# Altium project PressurePulse_Brain-PCB.PrjPcb (part 1 of 2)
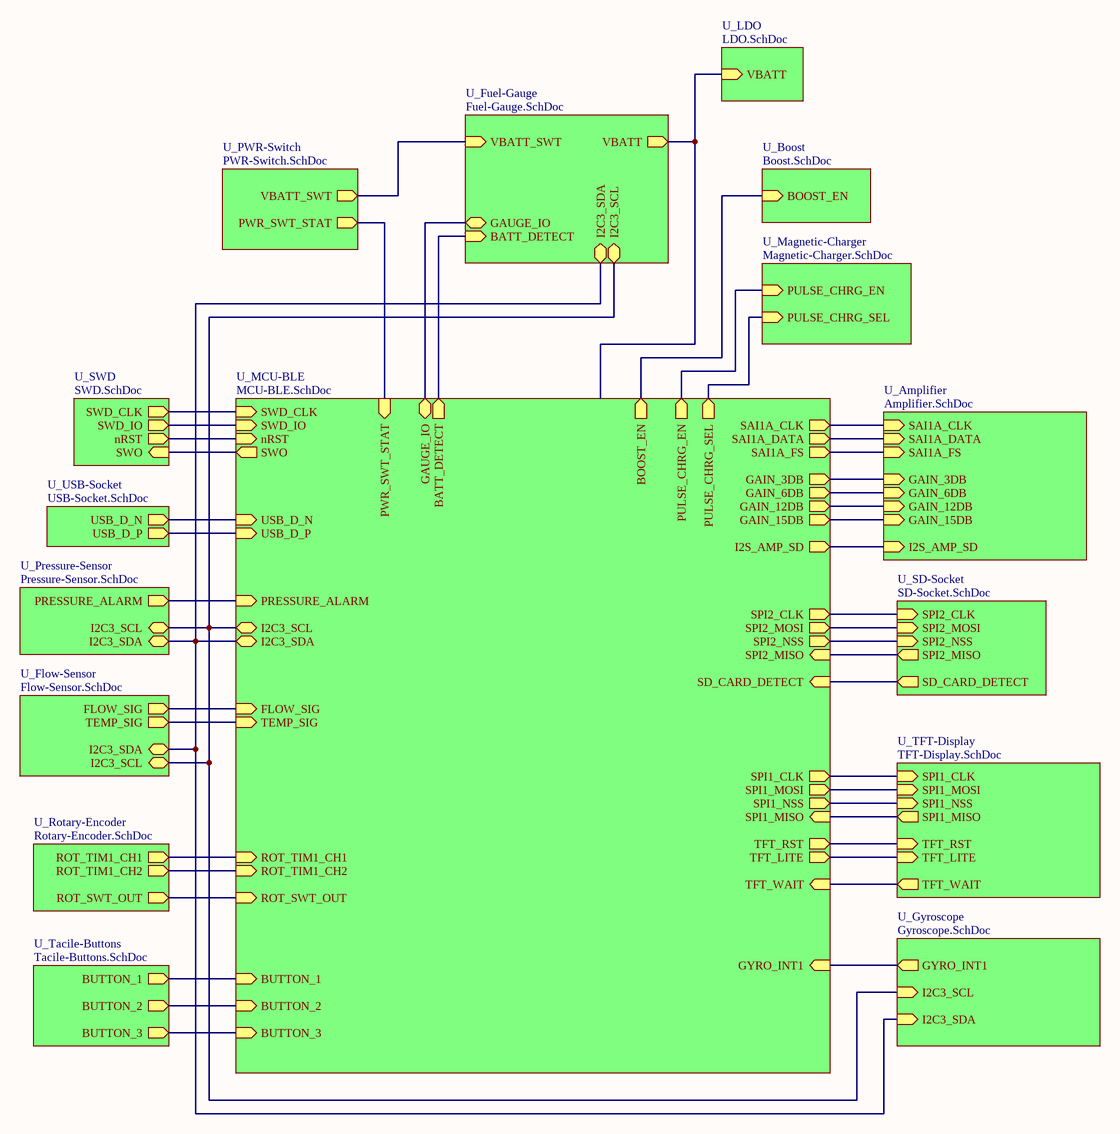
[diagram p0: PressurePulse_Brain-PCB_Master.SchDoc]
17 sheets, 241 parts. Net scope: hierarchical (ports join the sheet entries above them; power ports are global).
Board file: PressurePulse_Brain-PCB.PcbDoc
Sheets:
  PressurePulse_Brain-PCB_Master.SchDoc
    U_MCU-BLE = MCU-BLE.SchDoc
    U_SWD = SWD.SchDoc
    U_USB-Socket = USB-Socket.SchDoc
    U_Pressure-Sensor = Pressure-Sensor.SchDoc
    U_Flow-Sensor = Flow-Sensor.SchDoc
    U_PWR-Switch = PWR-Switch.SchDoc
    U_Fuel-Gauge = Fuel-Gauge.SchDoc
    U_LDO = LDO.SchDoc
    U_Boost = Boost.SchDoc
    U_Magnetic-Charger = Magnetic-Charger.SchDoc
    U_SD-Socket = SD-Socket.SchDoc
    U_TFT-Display = TFT-Display.SchDoc
    U_Amplifier = Amplifier.SchDoc
    U_Rotary-Encoder = Rotary-Encoder.SchDoc
    U_Tacile-Buttons = Tacile-Buttons.SchDoc
    U_Gyroscope = Gyroscope.SchDoc

## Sheet PressurePulse_Brain-PCB_Master.SchDoc
size B; SheetNumber: 1; SheetTotal: 17

### Sub-sheets
U_Amplifier = Amplifier.SchDoc: SAI1A_DATA (in), SAI1A_FS (in), SAI1A_CLK (in), GAIN_3DB (in), GAIN_6DB (in), GAIN_12DB (in), GAIN_15DB (in), I2S_AMP_SD (in)
U_Boost = Boost.SchDoc: BOOST_EN (in)
U_Flow-Sensor = Flow-Sensor.SchDoc: FLOW_SIG (out), TEMP_SIG (out), I2C3_SCL (bidir), I2C3_SDA (bidir)
U_Fuel-Gauge = Fuel-Gauge.SchDoc: I2C3_SCL (bidir), I2C3_SDA (bidir), GAUGE_IO (bidir), BATT_DETECT (in), VBATT_SWT (in), VBATT (out)
U_Gyroscope = Gyroscope.SchDoc: I2C3_SDA (in), GYRO_INT1 (out), I2C3_SCL (in)
U_LDO = LDO.SchDoc: VBATT (in)
U_Magnetic-Charger = Magnetic-Charger.SchDoc: PULSE_CHRG_EN (in), PULSE_CHRG_SEL (in)
U_MCU-BLE = MCU-BLE.SchDoc: SWO (out), SWD_CLK (in), SWD_IO (in), nRST (in), USB_D_N (in), USB_D_P (in), I2C3_SCL (bidir), I2C3_SDA (bidir), SAI1A_DATA (out), SAI1A_CLK (out), SAI1A_FS (out), SPI1_NSS (out), SPI1_CLK (out), SPI1_MISO (in), SPI1_MOSI (out), SPI2_NSS (out), SPI2_MISO (in), SPI2_MOSI (out), FLOW_SIG (in), TEMP_SIG (in), TFT_LITE (out), SPI2_CLK (out), TFT_WAIT (in), TFT_RST (out), BUTTON_1 (in), BUTTON_2 (in), BUTTON_3 (in), PULSE_CHRG_EN (out), SD_CARD_DETECT (in), GAIN_3DB (out), GAIN_6DB (out), GAIN_12DB (out), GAIN_15DB (out), ROT_SWT_OUT (in), PWR_SWT_STAT (in), GAUGE_IO (bidir), BATT_DETECT (out), I2S_AMP_SD (out), ROT_TIM1_CH1 (in), ROT_TIM1_CH2 (in), BOOST_EN (out), PRESSURE_ALARM (in), GYRO_INT1 (in), PULSE_CHRG_SEL (out)
U_Pressure-Sensor = Pressure-Sensor.SchDoc: I2C3_SDA (bidir), I2C3_SCL (bidir), PRESSURE_ALARM (out)
U_PWR-Switch = PWR-Switch.SchDoc: PWR_SWT_STAT (out), VBATT_SWT (out)
U_Rotary-Encoder = Rotary-Encoder.SchDoc: ROT_SWT_OUT (out), ROT_TIM1_CH1 (out), ROT_TIM1_CH2 (out)
U_SD-Socket = SD-Socket.SchDoc: SPI2_CLK (in), SPI2_MOSI (in), SD_CARD_DETECT (out), SPI2_NSS (in), SPI2_MISO (out)
U_SWD = SWD.SchDoc: nRST (out), SWD_IO (out), SWD_CLK (out), SWO (in)
U_Tacile-Buttons = Tacile-Buttons.SchDoc: BUTTON_1 (out), BUTTON_3 (out), BUTTON_2 (out)
U_TFT-Display = TFT-Display.SchDoc: TFT_LITE (in), SPI1_CLK (in), SPI1_MISO (out), SPI1_MOSI (in), SPI1_NSS (in), TFT_RST (in), TFT_WAIT (out)
U_USB-Socket = USB-Socket.SchDoc: USB_D_N (out), USB_D_P (out)

### Nets
VBATT: sheet U_Fuel-Gauge/VBATT, sheet U_LDO/VBATT
BATT_DETECT: sheet U_MCU-BLE/BATT_DETECT, sheet U_Fuel-Gauge/BATT_DETECT
FLOW_SIG: sheet U_MCU-BLE/FLOW_SIG, sheet U_Flow-Sensor/FLOW_SIG
GAUGE_IO: sheet U_MCU-BLE/GAUGE_IO, sheet U_Fuel-Gauge/GAUGE_IO
I2C3_SCL: sheet U_MCU-BLE/I2C3_SCL, sheet U_Pressure-Sensor/I2C3_SCL, sheet U_Flow-Sensor/I2C3_SCL, sheet U_Fuel-Gauge/I2C3_SCL, sheet U_Gyroscope/I2C3_SCL
I2C3_SDA: sheet U_MCU-BLE/I2C3_SDA, sheet U_Pressure-Sensor/I2C3_SDA, sheet U_Flow-Sensor/I2C3_SDA, sheet U_Fuel-Gauge/I2C3_SDA, sheet U_Gyroscope/I2C3_SDA
nRST: sheet U_MCU-BLE/nRST, sheet U_SWD/nRST
PWR_SWT_STAT: sheet U_MCU-BLE/PWR_SWT_STAT, sheet U_PWR-Switch/PWR_SWT_STAT
ROT_SWT_OUT: sheet U_MCU-BLE/ROT_SWT_OUT, sheet U_Rotary-Encoder/ROT_SWT_OUT
ROT_TIM1_CH1: sheet U_MCU-BLE/ROT_TIM1_CH1, sheet U_Rotary-Encoder/ROT_TIM1_CH1
ROT_TIM1_CH2: sheet U_MCU-BLE/ROT_TIM1_CH2, sheet U_Rotary-Encoder/ROT_TIM1_CH2
SAI1A_CLK: sheet U_MCU-BLE/SAI1A_CLK, sheet U_Amplifier/SAI1A_CLK
SAI1A_DATA: sheet U_MCU-BLE/SAI1A_DATA, sheet U_Amplifier/SAI1A_DATA
SAI1A_FS: sheet U_MCU-BLE/SAI1A_FS, sheet U_Amplifier/SAI1A_FS
SD_CARD_DETECT: sheet U_MCU-BLE/SD_CARD_DETECT, sheet U_SD-Socket/SD_CARD_DETECT
SPI1_CLK: sheet U_MCU-BLE/SPI1_CLK, sheet U_TFT-Display/SPI1_CLK
SPI1_MISO: sheet U_MCU-BLE/SPI1_MISO, sheet U_TFT-Display/SPI1_MISO
SPI1_MOSI: sheet U_MCU-BLE/SPI1_MOSI, sheet U_TFT-Display/SPI1_MOSI
SPI1_NSS: sheet U_MCU-BLE/SPI1_NSS, sheet U_TFT-Display/SPI1_NSS
SPI2_CLK: sheet U_MCU-BLE/SPI2_CLK, sheet U_SD-Socket/SPI2_CLK
SPI2_MISO: sheet U_MCU-BLE/SPI2_MISO, sheet U_SD-Socket/SPI2_MISO
SPI2_MOSI: sheet U_MCU-BLE/SPI2_MOSI, sheet U_SD-Socket/SPI2_MOSI
SPI2_NSS: sheet U_MCU-BLE/SPI2_NSS, sheet U_SD-Socket/SPI2_NSS
SWD_CLK: sheet U_MCU-BLE/SWD_CLK, sheet U_SWD/SWD_CLK
SWD_IO: sheet U_MCU-BLE/SWD_IO, sheet U_SWD/SWD_IO
SWO: sheet U_MCU-BLE/SWO, sheet U_SWD/SWO
TEMP_SIG: sheet U_MCU-BLE/TEMP_SIG, sheet U_Flow-Sensor/TEMP_SIG
TFT_WAIT: sheet U_MCU-BLE/TFT_WAIT, sheet U_TFT-Display/TFT_WAIT
USB_D_N: sheet U_MCU-BLE/USB_D_N, sheet U_USB-Socket/USB_D_N
USB_D_P: sheet U_MCU-BLE/USB_D_P, sheet U_USB-Socket/USB_D_P
VBATT_SWT: sheet U_PWR-Switch/VBATT_SWT, sheet U_Fuel-Gauge/VBATT_SWT
NetD22_K: sheet U_MCU-BLE/PRESSURE_ALARM, sheet U_Pressure-Sensor/PRESSURE_ALARM
NetD34_K: sheet U_MCU-BLE/TFT_RST, sheet U_TFT-Display/TFT_RST
NetD35_K: sheet U_MCU-BLE/TFT_LITE, sheet U_TFT-Display/TFT_LITE
NetJ12_2: sheet U_MCU-BLE/PULSE_CHRG_SEL, sheet U_Magnetic-Charger/PULSE_CHRG_SEL
NetQ6_G: sheet U_MCU-BLE/GAIN_3DB, sheet U_Amplifier/GAIN_3DB
NetQ7_G: sheet U_MCU-BLE/GAIN_6DB, sheet U_Amplifier/GAIN_6DB
NetQ8_G: sheet U_MCU-BLE/GAIN_15DB, sheet U_Amplifier/GAIN_15DB
NetQ9_G: sheet U_MCU-BLE/GAIN_12DB, sheet U_Amplifier/GAIN_12DB
NetR22_2: sheet U_MCU-BLE/BOOST_EN, sheet U_Boost/BOOST_EN
NetR61_2: sheet U_MCU-BLE/PULSE_CHRG_EN, sheet U_Magnetic-Charger/PULSE_CHRG_EN
NetR67_2: sheet U_MCU-BLE/I2S_AMP_SD, sheet U_Amplifier/I2S_AMP_SD
NetSW3_1: sheet U_MCU-BLE/BUTTON_1, sheet U_Tacile-Buttons/BUTTON_1
NetSW4_1: sheet U_MCU-BLE/BUTTON_2, sheet U_Tacile-Buttons/BUTTON_2
NetSW5_1: sheet U_MCU-BLE/BUTTON_3, sheet U_Tacile-Buttons/BUTTON_3
NetU6_17: sheet U_MCU-BLE/GYRO_INT1, sheet U_Gyroscope/GYRO_INT1

## Sheet MCU-BLE.SchDoc
size 431 x 304 mm; SheetNumber: 6; SheetTotal: 17
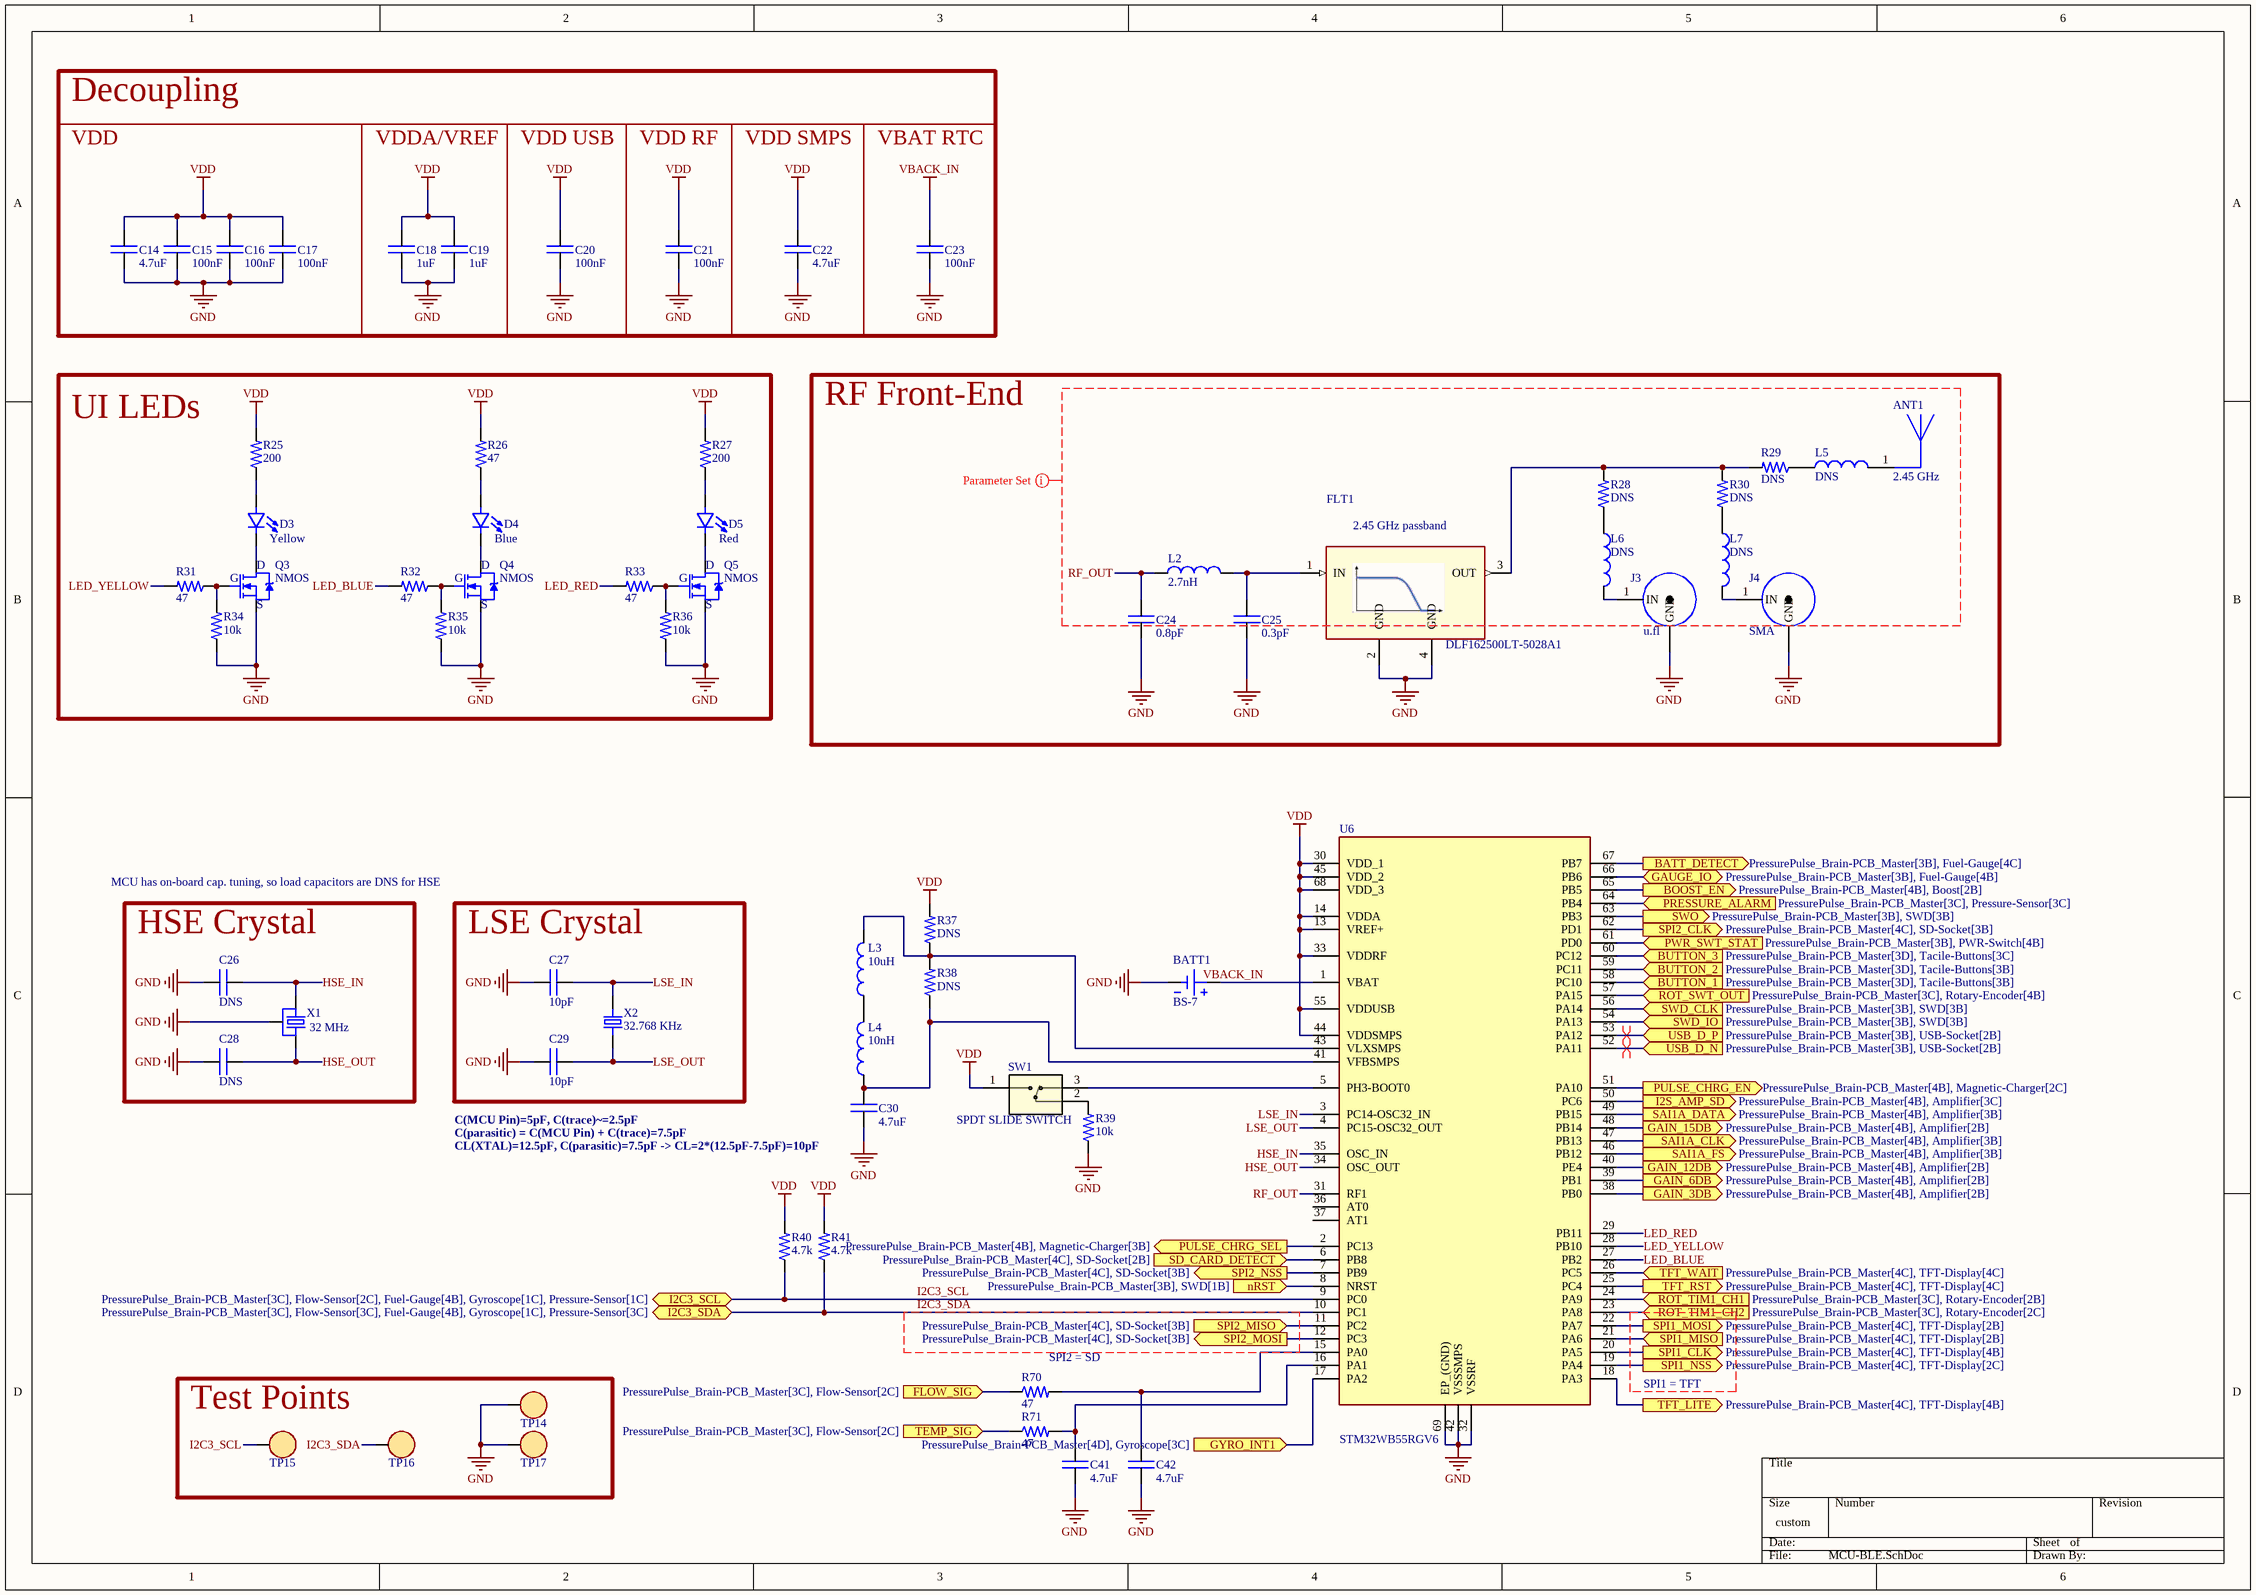
[diagram p1: MCU-BLE.SchDoc]

### Parts
ANT1  Center Frequency: 2.45 GHz  [ANT_ANT7020LL05R0870A_PUL-L]  (hidden comment: CHIP ANTENNA)
BATT1  BS-7  [BAT_BS-7]
C14  value 4.7uF  [0402C]  (hidden comment: CAP)
C15  value 100nF  [0402C]  (hidden comment: CAP)
C16  value 100nF  [0402C]  (hidden comment: CAP)
C17  value 100nF  [0402C]  (hidden comment: CAP)
C18  value 1uF  [0402C]  (hidden comment: CAP)
C19  value 1uF  [0402C]  (hidden comment: CAP)
C20  value 100nF  [0402C]  (hidden comment: CAP)
C21  value 100nF  [0402C]  (hidden comment: CAP)
C22  value 4.7uF  [0402C]  (hidden comment: CAP)
C23  value 100nF  [0402C]  (hidden comment: CAP)
C24  value 0.8pF  [0603C]  (hidden comment: CAP)
C25  value 0.3pF  [0402C]  (hidden comment: CAP)
C26  value DNS  [0402C]  (hidden comment: CAP)
C27  value 10pF  [0402C]  (hidden comment: CAP)
C28  value DNS  [0402C]  (hidden comment: CAP)
C29  value 10pF  [0402C]  (hidden comment: CAP)
C30  value 4.7uF  [0402C]  (hidden comment: CAP)
C41  value 4.7uF  [0402C]  (hidden comment: CAP)
C42  value 4.7uF  [0402C]  (hidden comment: CAP)
D3  Color: Yellow  [0603-LED]  (hidden comment: LED - single)
D4  Color: Blue  [0603-LED]  (hidden comment: LED - single)
D5  Color: Red  [0603-LED]  (hidden comment: LED - single)
FLT1  DLF162500LT-5028A1  [DLF-4_1P6X0P8]
J3  u.fl  [U.FL]
J4  SMA  [SMA TH RA]
L2  value 2.7nH  [0402L]  (hidden comment: IND)
L3  value 10uH  [0805L]  (hidden comment: IND)
L4  value 10nH  [0402L]  (hidden comment: IND)
L5  value DNS  [0402L]  (hidden comment: IND)
L6  value DNS  [0402L]  (hidden comment: IND)
L7  value DNS  [0402L]  (hidden comment: IND)
Q3  NMOS  [SOT-23]
Q4  NMOS  [SOT-23]
Q5  NMOS  [SOT-23]
R25  value 200  [0402R]  (hidden comment: RES)
R26  value 47  [0402R]  (hidden comment: RES)
R27  value 200  [0402R]  (hidden comment: RES)
R28  value DNS  [0402R]  (hidden comment: RES)
R29  value DNS  [0402R]  (hidden comment: RES)
R30  value DNS  [0402R]  (hidden comment: RES)
R31  value 47  [0402R]  (hidden comment: RES)
R32  value 47  [0402R]  (hidden comment: RES)
R33  value 47  [0402R]  (hidden comment: RES)
R34  value 10k  [0402R]  (hidden comment: RES)
R35  value 10k  [0402R]  (hidden comment: RES)
R36  value 10k  [0402R]  (hidden comment: RES)
R37  value DNS  [0402R]  (hidden comment: RES)
R38  value DNS  [0402R]  (hidden comment: RES)
R39  value 10k  [0402R]  (hidden comment: RES)
R40  value 4.7k  [0402R]  (hidden comment: RES)
R41  value 4.7k  [0402R]  (hidden comment: RES)
R70  value 47  [0402R]  (hidden comment: RES)
R71  value 47  [0402R]  (hidden comment: RES)
SW1  SPDT SLIDE SWITCH  [JS102011SCQN]
TP14  RH-5019  [TP - RH-5019]  (value not drawn)
TP15  RH-5019  [TP - RH-5019]  (value not drawn)
TP16  RH-5019  [TP - RH-5019]  (value not drawn)
TP17  RH-5019  [TP - RH-5019]  (value not drawn)
U6  STM32WB55RGV6  [VQFN-68]
X1  Frequency: 32 MHz  [32MHZ_SMD1612-4P]  (hidden comment: XTAL-OSC_32MHz)
X2  Frequency: 32.768 KHz  [XTAL_ECS-.327-12.5-34B-TR]  (hidden comment: XTAL-OSC_32.768kHz)

### Blocks framed on the sheet
Decoupling: C14-C17
VDDA/VREF: C18 C19
VDD USB: C20
VDD RF: C21
VDD SMPS: C22
VBAT RTC: C23
UI LEDs: D3-D5 Q3-Q5 R25-R27 R31-R36
RF Front-End: ANT1 C24 C25 FLT1 J3 J4 L2 L5-L7 R28-R30
HSE Crystal: C26 C28 X1
LSE Crystal: C27 C29 X2
Test Points: TP14-TP17

### Ports
BATT_DETECT (out, see PressurePulse_Brain-PCB_Master[3B], Fuel-Gauge[4C]), BOOST_EN (out, see PressurePulse_Brain-PCB_Master[4B], Boost[2B]), BUTTON_1 (in, see PressurePulse_Brain-PCB_Master[3D], Tacile-Buttons[3B]), BUTTON_2 (in, see PressurePulse_Brain-PCB_Master[3D], Tacile-Buttons[3B]), BUTTON_3 (in, see PressurePulse_Brain-PCB_Master[3D], Tacile-Buttons[3C]), FLOW_SIG (in, see PressurePulse_Brain-PCB_Master[3C], Flow-Sensor[2C]), GAIN_3DB (out, see PressurePulse_Brain-PCB_Master[4B], Amplifier[2B]), GAIN_6DB (out, see PressurePulse_Brain-PCB_Master[4B], Amplifier[2B]), GAIN_12DB (out, see PressurePulse_Brain-PCB_Master[4B], Amplifier[2B]), GAIN_15DB (out, see PressurePulse_Brain-PCB_Master[4B], Amplifier[2B]), GAUGE_IO (bidir, see PressurePulse_Brain-PCB_Master[3B], Fuel-Gauge[4B]), GYRO_INT1 (in, see PressurePulse_Brain-PCB_Master[4D], Gyroscope[3C]), I2C3_SCL (bidir, see PressurePulse_Brain-PCB_Master[3C], Flow-Sensor[2C], Fuel-Gauge[4B], Gyroscope[1C], Pressure-Sensor[1C]), I2C3_SDA (bidir, see PressurePulse_Brain-PCB_Master[3C], Flow-Sensor[3C], Fuel-Gauge[4B], Gyroscope[1C], Pressure-Sensor[3C]), I2S_AMP_SD (out, see PressurePulse_Brain-PCB_Master[4B], Amplifier[3C]), nRST (in, see PressurePulse_Brain-PCB_Master[3B], SWD[1B]), PRESSURE_ALARM (in, see PressurePulse_Brain-PCB_Master[3C], Pressure-Sensor[3C]), PULSE_CHRG_EN (out, see PressurePulse_Brain-PCB_Master[4B], Magnetic-Charger[2C]), PULSE_CHRG_SEL (out, see PressurePulse_Brain-PCB_Master[4B], Magnetic-Charger[3B]), PWR_SWT_STAT (in, see PressurePulse_Brain-PCB_Master[3B], PWR-Switch[4B]), ROT_SWT_OUT (in, see PressurePulse_Brain-PCB_Master[3C], Rotary-Encoder[4B]), ROT_TIM1_CH1 (in, see PressurePulse_Brain-PCB_Master[3C], Rotary-Encoder[2B]), ROT_TIM1_CH2 (in, see PressurePulse_Brain-PCB_Master[3C], Rotary-Encoder[2C]), SAI1A_CLK (out, see PressurePulse_Brain-PCB_Master[4B], Amplifier[3B]), SAI1A_DATA (out, see PressurePulse_Brain-PCB_Master[4B], Amplifier[3B]), SAI1A_FS (out, see PressurePulse_Brain-PCB_Master[4B], Amplifier[3B]), SD_CARD_DETECT (in, see PressurePulse_Brain-PCB_Master[4C], SD-Socket[2B]), SPI1_CLK (out, see PressurePulse_Brain-PCB_Master[4C], TFT-Display[4B]), SPI1_MISO (in, see PressurePulse_Brain-PCB_Master[4C], TFT-Display[2B]), SPI1_MOSI (out, see PressurePulse_Brain-PCB_Master[4C], TFT-Display[2B]), SPI1_NSS (out, see PressurePulse_Brain-PCB_Master[4C], TFT-Display[2C]), SPI2_CLK (out, see PressurePulse_Brain-PCB_Master[4C], SD-Socket[3B]), SPI2_MISO (in, see PressurePulse_Brain-PCB_Master[4C], SD-Socket[3B]), SPI2_MOSI (out, see PressurePulse_Brain-PCB_Master[4C], SD-Socket[3B]), SPI2_NSS (out, see PressurePulse_Brain-PCB_Master[4C], SD-Socket[3B]), SWD_CLK (in, see PressurePulse_Brain-PCB_Master[3B], SWD[3B]), SWD_IO (in, see PressurePulse_Brain-PCB_Master[3B], SWD[3B]), SWO (out, see PressurePulse_Brain-PCB_Master[3B], SWD[3B]), TEMP_SIG (in, see PressurePulse_Brain-PCB_Master[3C], Flow-Sensor[2C]), TFT_LITE (out, see PressurePulse_Brain-PCB_Master[4C], TFT-Display[4B]), TFT_RST (out, see PressurePulse_Brain-PCB_Master[4C], TFT-Display[4C]), TFT_WAIT (in, see PressurePulse_Brain-PCB_Master[4C], TFT-Display[4C]), USB_D_N (in, see PressurePulse_Brain-PCB_Master[3B], USB-Socket[2B]), USB_D_P (in, see PressurePulse_Brain-PCB_Master[3B], USB-Socket[2B])

### Nets
GND: BATT1.2(NEG) C14.1 C15.1 C16.1 C17.1 C18.1 C19.1 C20.1 C21.1 C22.1 C23.1 C24.1 C25.1 C26.2 C27.2 C28.2 C29.2 C30.1 C41.1 C42.1 FLT1.2(GND) FLT1.4(GND) J3.GND J4.GND Q3.S Q4.S Q5.S R34.1 R35.1 R36.1 R39.1 TP14.1 TP17.1 U6.32(VSSRF) U6.42(VSSSMPS) U6.69(EP_(GND)) X1.GND
VBACK_IN: BATT1.1(POS) C23.2 U6.1(VBAT)
VDD: C14.2 C15.2 C16.2 C17.2 C18.2 C19.2 C20.2 C21.2 C22.2 R25.2 R26.2 R27.2 R37.2 R40.2 R41.2 SW1.1 U6.13(VREF+) U6.14(VDDA) U6.30(VDD_1) U6.33(VDDRF) U6.44(VDDSMPS) U6.45(VDD_2) U6.55(VDDUSB) U6.68(VDD_3)
BATT_DETECT: U6.67(PB7) ; port BATT_DETECT
FLOW_SIG: R70.1 ; port FLOW_SIG
GAUGE_IO: U6.66(PB6) ; port GAUGE_IO
HSE_IN: C26.1 U6.35(OSC_IN) X1.1
HSE_OUT: C28.1 U6.34(OSC_OUT) X1.3
I2C3_SCL: R40.1 TP15.1 U6.9(PC0) ; port I2C3_SCL
I2C3_SDA: R41.1 TP16.1 U6.10(PC1) ; port I2C3_SDA
LED_BLUE: R32.2 U6.27(PB2)
LED_RED: R33.2 U6.29(PB11)
LED_YELLOW: R31.2 U6.28(PB10)
LSE_IN: C27.1 U6.3(PC14-OSC32_IN) X2.2
LSE_OUT: C29.1 U6.4(PC15-OSC32_OUT) X2.1
nRST: U6.8(NRST) ; port nRST
PWR_SWT_STAT: U6.61(PD0) ; port PWR_SWT_STAT
RF_OUT: C24.2 L2.1 U6.31(RF1)
ROT_SWT_OUT: U6.57(PA15) ; port ROT_SWT_OUT
ROT_TIM1_CH1: U6.24(PA9) ; port ROT_TIM1_CH1
ROT_TIM1_CH2: U6.23(PA8) ; port ROT_TIM1_CH2
SAI1A_CLK: U6.47(PB13) ; port SAI1A_CLK
SAI1A_DATA: U6.49(PB15) ; port SAI1A_DATA
SAI1A_FS: U6.46(PB12) ; port SAI1A_FS
SD_CARD_DETECT: U6.6(PB8) ; port SD_CARD_DETECT
SPI1_CLK: U6.20(PA5) ; port SPI1_CLK
SPI1_MISO: U6.21(PA6) ; port SPI1_MISO
SPI1_MOSI: U6.22(PA7) ; port SPI1_MOSI
SPI1_NSS: U6.19(PA4) ; port SPI1_NSS
SPI2_CLK: U6.62(PD1) ; port SPI2_CLK
SPI2_MISO: U6.11(PC2) ; port SPI2_MISO
SPI2_MOSI: U6.12(PC3) ; port SPI2_MOSI
SPI2_NSS: U6.7(PB9) ; port SPI2_NSS
SWD_CLK: U6.56(PA14) ; port SWD_CLK
SWD_IO: U6.54(PA13) ; port SWD_IO
SWO: U6.63(PB3) ; port SWO
TEMP_SIG: R71.1 ; port TEMP_SIG
TFT_WAIT: U6.26(PC5) ; port TFT_WAIT
USB_D_N: U6.52(PA11) ; port USB_D_N
USB_D_P: U6.53(PA12) ; port USB_D_P
NetANT1_1: ANT1.1 L5.2
NetC25_2: C25.2 FLT1.1(IN) L2.2
NetC30_2: C30.2 L4.1 R38.1 U6.41(VFBSMPS)
NetC41_2: C41.2 R71.2 U6.16(PA1)
NetC42_2: C42.2 R70.2 U6.15(PA0)
NetD3_1: D3.1(A) R25.1
NetD3_2: D3.2(C) Q3.D
NetD4_1: D4.1(A) R26.1
NetD4_2: D4.2(C) Q4.D
NetD5_1: D5.1(A) R27.1
NetD5_2: D5.2(C) Q5.D
NetD22_K: U6.64(PB4) ; port PRESSURE_ALARM
NetD34_K: U6.25(PC4) ; port TFT_RST
NetD35_K: U6.18(PA3) ; port TFT_LITE
NetFLT1_3: FLT1.3(OUT) R28.2 R29.2 R30.2
NetJ3_1: J3.1(IN) L6.2
NetJ4_1: J4.1(IN) L7.2
NetJ12_2: U6.2(PC13) ; port PULSE_CHRG_SEL
NetL3_1: L3.1 L4.2
NetL3_2: L3.2 R37.1 R38.2 U6.43(VLXSMPS)
NetL5_1: L5.1 R29.1
NetL6_1: L6.1 R28.1
NetL7_1: L7.1 R30.1
NetQ3_G: Q3.G R31.1 R34.2
NetQ4_G: Q4.G R32.1 R35.2
NetQ5_G: Q5.G R33.1 R36.2
NetQ6_G: U6.38(PB0) ; port GAIN_3DB
NetQ7_G: U6.39(PB1) ; port GAIN_6DB
NetQ8_G: U6.48(PB14) ; port GAIN_15DB
NetQ9_G: U6.40(PE4) ; port GAIN_12DB
NetR22_2: U6.65(PB5) ; port BOOST_EN
NetR39_2: R39.2 SW1.2
NetR61_2: U6.51(PA10) ; port PULSE_CHRG_EN
NetR67_2: U6.50(PC6) ; port I2S_AMP_SD
NetSW1_3: SW1.3 U6.5(PH3-BOOT0)
NetSW3_1: U6.58(PC10) ; port BUTTON_1
NetSW4_1: U6.59(PC11) ; port BUTTON_2
NetSW5_1: U6.60(PC12) ; port BUTTON_3
NetU6_17: U6.17(PA2) ; port GYRO_INT1

Not connected (* = marked no-connect by the designer): U6 36(AT0) 37(AT1)

### Layout directives
differential pair: USB_D_N, USB_D_P
net class RF: RF_OUT

### Notes on the sheet
- VDD
- MCU has on-board cap. tuning, so load capacitors are DNS for HSE
- (near C30) CL(XTAL)=12.5pF, C(parasitic)=7.5pF -> CL=2*(12.5pF-7.5pF)=10pF
- C(MCU Pin)=5pF, C(trace)~=2.5pF
- C(parasitic) = C(MCU Pin) + C(trace)=7.5pF
- (near R70) SPI2 = SD
- SPI1 = TFT
- (in symbol 2.45GHz LPF) 2.45 GHz passband

### Library data of the parts
ANT1 = CHIP ANTENNA: MFR: Pulse Electronics; MFR PN: ANT7020LL05R2400A; Value: DNS; JLCPCB PN: DNS
BATT1 = COIN CELL BATT: Battery Holder (Open) Coin, 20.0mm 1 Cell PC Pin; MP: BS-2-1; MF: Q&J; Value: BS-2-1; JLCPCB PN: C70376
C14-C23 C26 C28 C30 = CAP: Capaicitor; MFR: *; MFR PN: *
C24 C25 C41 C42 = CAP: Capacitor; MFR: *; MFR PN: *
  C24: JLCPCB PN: C907996; Footprint: 0603
  C25: JLCPCB PN: C2986289; Footprint: *
  C41 C42: JLCPCB PN: *; Footprint: *
C27 C29 = CAP: Capaicitor; MFR PN: FN15N100J500PNG; MFR: *; JLCPCB PN: C328913
D3 = LED - single: LED; Value: 19-213/Y2C-CQ2R2L/3T(CY); MFR: *; MFR PN: *; JLCPCB PN: C72038
D4 = LED - single: LED; Value: D-060306B1; MFR: *; MFR PN: *; JLCPCB PN: C118339
D5 = LED - single: LED; Value: KT-0603R; MFR: *; MFR PN: *; JLCPCB PN: C2286
FLT1 = 2.45GHz LPF: RF FILTER LOW PASS 2.45GHZ 0603; MFR: TDK; MFR PN: DLF162500LT-5028A1; Value: DLF162500LT-5028A1; JLCPCB PN: C531364
J3 = u.fl CONN: u.fl 50Ohm; MFR: HRS(Hirose); MFR PN: U.FL-R-SMT-1(80); Value: U.FL-R-SMT-1(80); JLCPCB PN: C88374
J4 = SMA: SMA 50Ohm; MFR: DreamLNK; MFR PN: SMA-KWE901; Value: SMA-KWE901; JLCPCB PN: C914553
L2-L7 = IND: INDUCTOR; Footprint: *
  L2: JLCPCB PN: C963981
  L4: JLCPCB PN: C963995
  L5-L7: JLCPCB PN: *
Q3-Q5 = NMOS: 100V 1.6A 1.3W 220mΩ@10V,1.6A N Channel SOT-23  MOSFETs ROHS; MFR: Infineon; Value: IRLML0100TRPBF; MFR PN: IRLML0100TRPBF; JLCPCB PN: C53658
R25-R41 R70 R71 = RES: Resistor; MFR PN: *; MFR: *
  R25-R27 R37 R38: Type: SMD
  R28-R33 R40 R41 R70 R71: JLCPCB PN: *
  R34-R36: JLCPCB PN: C843837
  R39: Type: SMD; JLCPCB PN: C843837
SW1 = SPDT SLIDE SWITCH: MFR: C&K; Value: JS102011SCQN; MFR PN: JS102011SCQN; Type: SMD; JLCPCB PN: C221661
TP14-TP17 = TEST POINT: MFR: ronghe; MFR PN: RH-5019; Value: RH-5019; JLCPCB PN: C5199800
U6 = STM32WB55RGV6: ARM Microcontrollers - MCU Ultra-low-power dual core Arm Cortex-M4 MCU 64 MHz, Cortex-M0 32MHz with 1 Mbyte Flash, BLE, 802.15.4, USB, LCD, AES-256; MFR: STMicroelectronics; Value: STM32WB55RGV6; JLCPCB PN: C401505
X1 = XTAL-OSC_32MHz: SMD Tuning Fork Crystal; MFR PN: Murata; Value: XRCMD32M000FXP50R0; Type: SMD; JLCPCB PN: C341820
X2 = XTAL-OSC_32.768kHz: 32.768kHz 12.5pF ±20ppm SMD3215-2P  Crystals ROHS; MFR: CITIZEN; MFR PN: CM315D32768DZFT; Value: CM315D32768DZFT; JLCPCB PN: C182057

## Sheet SWD.SchDoc
size A; SheetNumber: 7; SheetTotal: 17
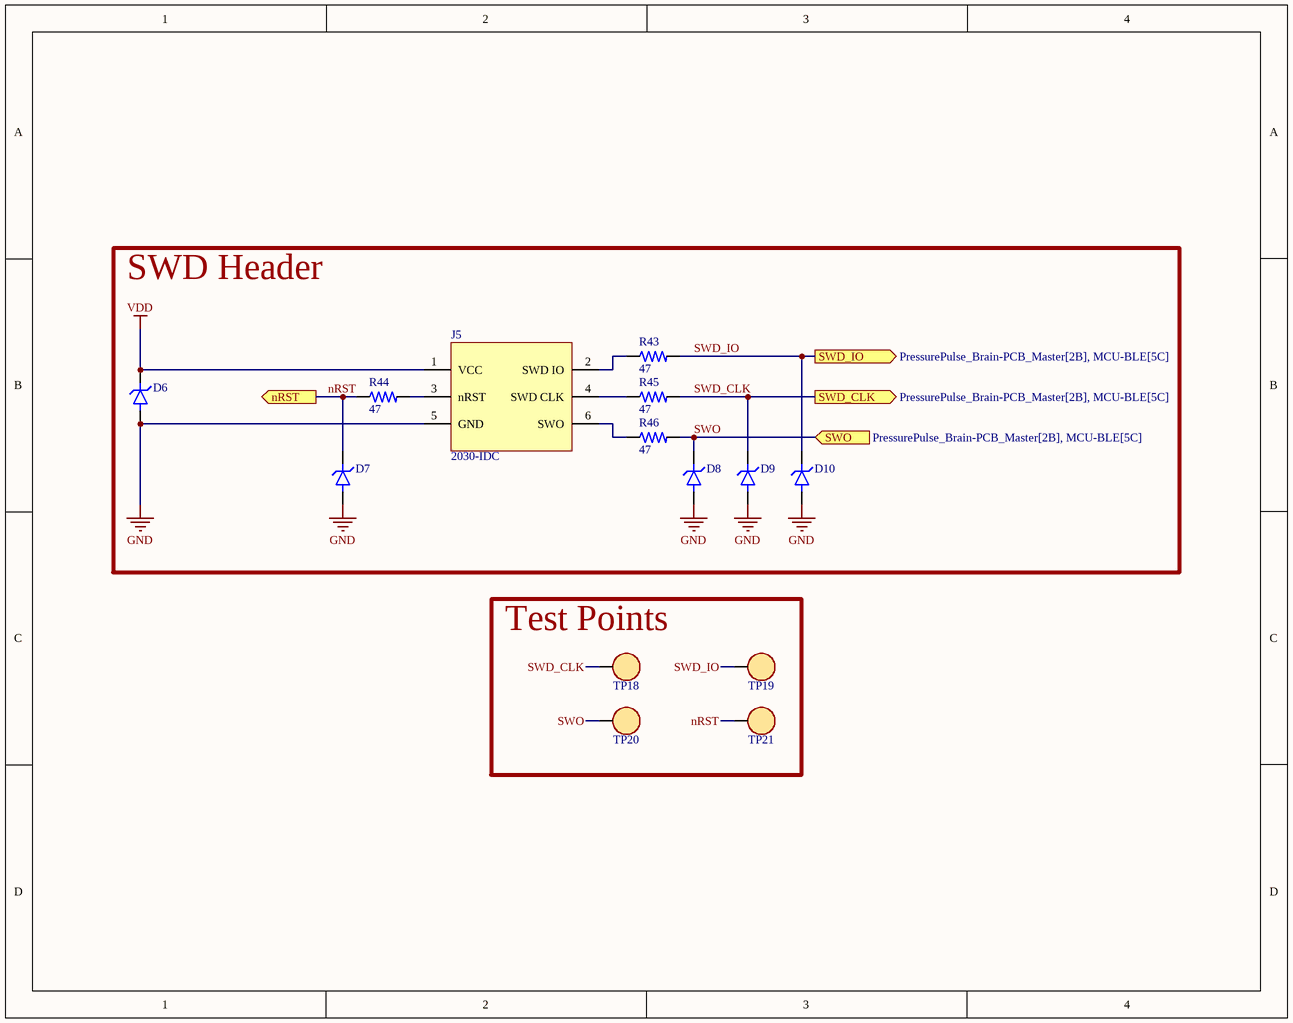
[diagram p2: SWD.SchDoc]

### Parts
D6  RCLAMP0521P.TCT  [BDFN2C051V40]  (value not drawn)
D7  RCLAMP0521P.TCT  [BDFN2C051V40]  (value not drawn)
D8  RCLAMP0521P.TCT  [BDFN2C051V40]  (value not drawn)
D9  RCLAMP0521P.TCT  [BDFN2C051V40]  (value not drawn)
D10  RCLAMP0521P.TCT  [BDFN2C051V40]  (value not drawn)
J5  2030-IDC  [TAG CONNECT TC2030IDC - NO 3D MODEL]
R43  value 47  [0402R]  (hidden comment: RES)
R44  value 47  [0402R]  (hidden comment: RES)
R45  value 47  [0402R]  (hidden comment: RES)
R46  value 47  [0402R]  (hidden comment: RES)
TP18  RH-5019  [TP - RH-5019]  (value not drawn)
TP19  RH-5019  [TP - RH-5019]  (value not drawn)
TP20  RH-5019  [TP - RH-5019]  (value not drawn)
TP21  RH-5019  [TP - RH-5019]  (value not drawn)

### Blocks framed on the sheet
SWD Header: D6-D10 J5 R43-R46
Test Points: TP18-TP21

### Ports
nRST (out, see PressurePulse_Brain-PCB_Master[2B], MCU-BLE[4D]), SWD_CLK (out, see PressurePulse_Brain-PCB_Master[2B], MCU-BLE[5C]), SWD_IO (out, see PressurePulse_Brain-PCB_Master[2B], MCU-BLE[5C]), SWO (in, see PressurePulse_Brain-PCB_Master[2B], MCU-BLE[5C])

### Nets
GND: D6.A D7.A D8.A D9.A D10.A J5.5(GND)
VDD: D6.K J5.1(VCC)
nRST: D7.K R44.1 TP21.1 ; port nRST
SWD_CLK: D9.K R45.2 TP18.1 ; port SWD_CLK
SWD_IO: D10.K R43.2 TP19.1 ; port SWD_IO
SWO: D8.K R46.2 TP20.1 ; port SWO
NetJ5_2: J5.2(SWD_IO) R43.1
NetJ5_3: J5.3(nRST) R44.2
NetJ5_4: J5.4(SWD_CLK) R45.1
NetJ5_6: J5.6(SWO) R46.1

### Library data of the parts
D6-D10 = TVS DIODE: 25V Clamp 4A (8/20µs) Ipp Tvs Diode Surface Mount SLP1006P2; MFR: BORN; Type: SMD; Value: BDFN2C051V40; MFR PN: BDFN2C051V40; JLCPCB PN: C152023
J5 = TAG CONNECT 2030-IDC: MFR PN: TC2030-IDC; Value: DNS; MFR: Tag Connect
R43-R46 = RES: Resistor; MFR PN: *; MFR: *; JLCPCB PN: *
TP18-TP21 = TEST POINT: MFR: ronghe; MFR PN: RH-5019; Value: RH-5019; JLCPCB PN: C5199800

## Sheet USB-Socket.SchDoc
size A; SheetNumber: 10; SheetTotal: 17
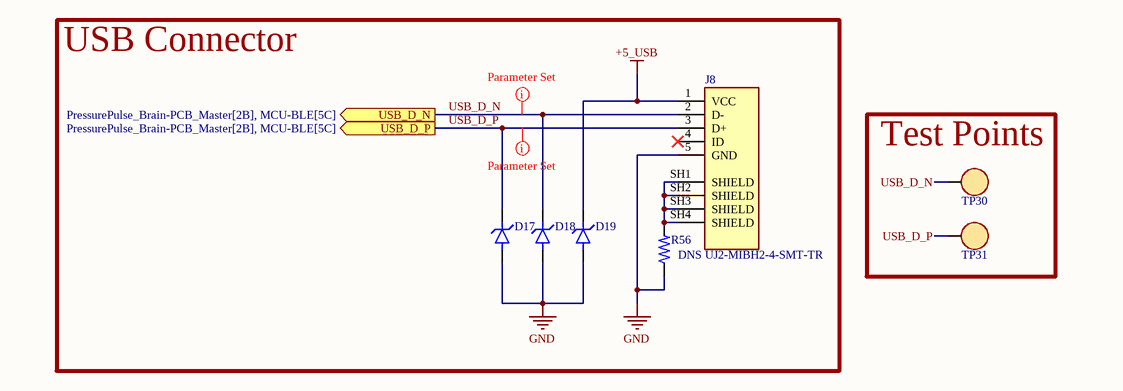
[diagram p3: USB-Socket.SchDoc]

### Parts
D17  RCLAMP0521P.TCT  [BDFN2C051V40]  (value not drawn)
D18  RCLAMP0521P.TCT  [BDFN2C051V40]  (value not drawn)
D19  RCLAMP0521P.TCT  [BDFN2C051V40]  (value not drawn)
J8  UJ2-MIBH2-4-SMT-TR  [USB MICRO JLC]
R56  value DNS  [0402R]  (hidden comment: RES)
TP30  RH-5019  [TP - RH-5019]  (value not drawn)
TP31  RH-5019  [TP - RH-5019]  (value not drawn)

### Blocks framed on the sheet
USB Connector: D17-D19 J8 R56
Test Points: TP30 TP31

### Ports
USB_D_N (out, see PressurePulse_Brain-PCB_Master[2B], MCU-BLE[5C]), USB_D_P (out, see PressurePulse_Brain-PCB_Master[2B], MCU-BLE[5C])

### Nets
+5_USB: D19.K J8.1(VCC)
GND: D17.A D18.A D19.A J8.5(GND) R56.1
USB_D_N: D18.K J8.2(D-) TP30.1 ; port USB_D_N
USB_D_P: D17.K J8.3(D+) TP31.1 ; port USB_D_P
NetJ8_SH1: J8.SH1(SHIELD) J8.SH2(SHIELD) J8.SH3(SHIELD) J8.SH4(SHIELD) R56.2

Not connected (* = marked no-connect by the designer): J8 4(ID)*

### Layout directives
net class USB: USB_D_N, USB_D_P

### Library data of the parts
D17-D19 = TVS DIODE: as D6 on sheet SWD; MFR PN: BDFN2C051V40; JLCPCB PN: C152023
J8 = Micro USB Port: Micro B, USB 2.0, 1.8 A, Right Angle, Surface Mount (SMT), USB Receptacle; MFR: CUI Devices; Value: UA0507065250-037-06; JLCPCB PN: C5249562
R56 = RES: Resistor; MFR PN: *; MFR: *; JLCPCB PN: *
TP30 TP31 = TEST POINT: MFR: ronghe; MFR PN: RH-5019; Value: RH-5019; JLCPCB PN: C5199800

## Sheet Pressure-Sensor.SchDoc
size A; SheetNumber: 11; SheetTotal: 17
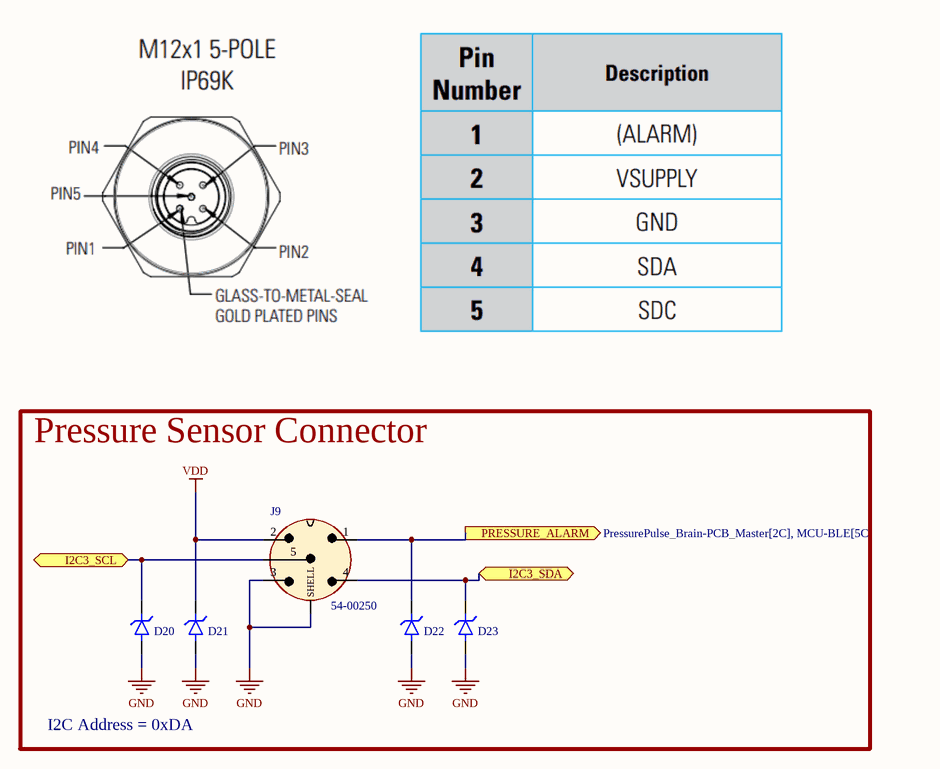
[diagram p4: Pressure-Sensor.SchDoc]

### Parts
D20  RCLAMP0521P.TCT  [BDFN2C051V40]  (value not drawn)
D21  RCLAMP0521P.TCT  [BDFN2C051V40]  (value not drawn)
D22  RCLAMP0521P.TCT  [BDFN2C051V40]  (value not drawn)
D23  RCLAMP0521P.TCT  [BDFN2C051V40]  (value not drawn)
J9  54-00250  [TENSILITY_54-00250]

### Ports
I2C3_SCL (bidir, see PressurePulse_Brain-PCB_Master[2C], Flow-Sensor[2C], Fuel-Gauge[4B], Gyroscope[1C], MCU-BLE[2D]), I2C3_SDA (bidir, see PressurePulse_Brain-PCB_Master[2C], Flow-Sensor[3C], Fuel-Gauge[4B], Gyroscope[1C], MCU-BLE[2D]), PRESSURE_ALARM (out, see PressurePulse_Brain-PCB_Master[2C], MCU-BLE[5C])

### Nets
GND: D20.A D21.A D22.A D23.A J9.3 J9.SHELL
VDD: D21.K J9.2
I2C3_SCL: D20.K J9.5 ; port I2C3_SCL
I2C3_SDA: D23.K J9.4 ; port I2C3_SDA
NetD22_K: D22.K J9.1 ; port PRESSURE_ALARM

### Notes on the sheet
- Pressure Sensor Connector
- I2C Address = 0xDA

### Library data of the parts
D20-D23 = TVS DIODE: as D6 on sheet SWD; MFR PN: BDFN2C051V40; JLCPCB PN: C152023
J9 = M12 5POS TH RA: CONN PLUG MALE 5POS GOLD SOLDER; MFR: Tensility International Corp; Value: DNS; MFR PN: 54-00250

## Sheet Flow-Sensor.SchDoc
size A; SheetNumber: 12; SheetTotal: 17
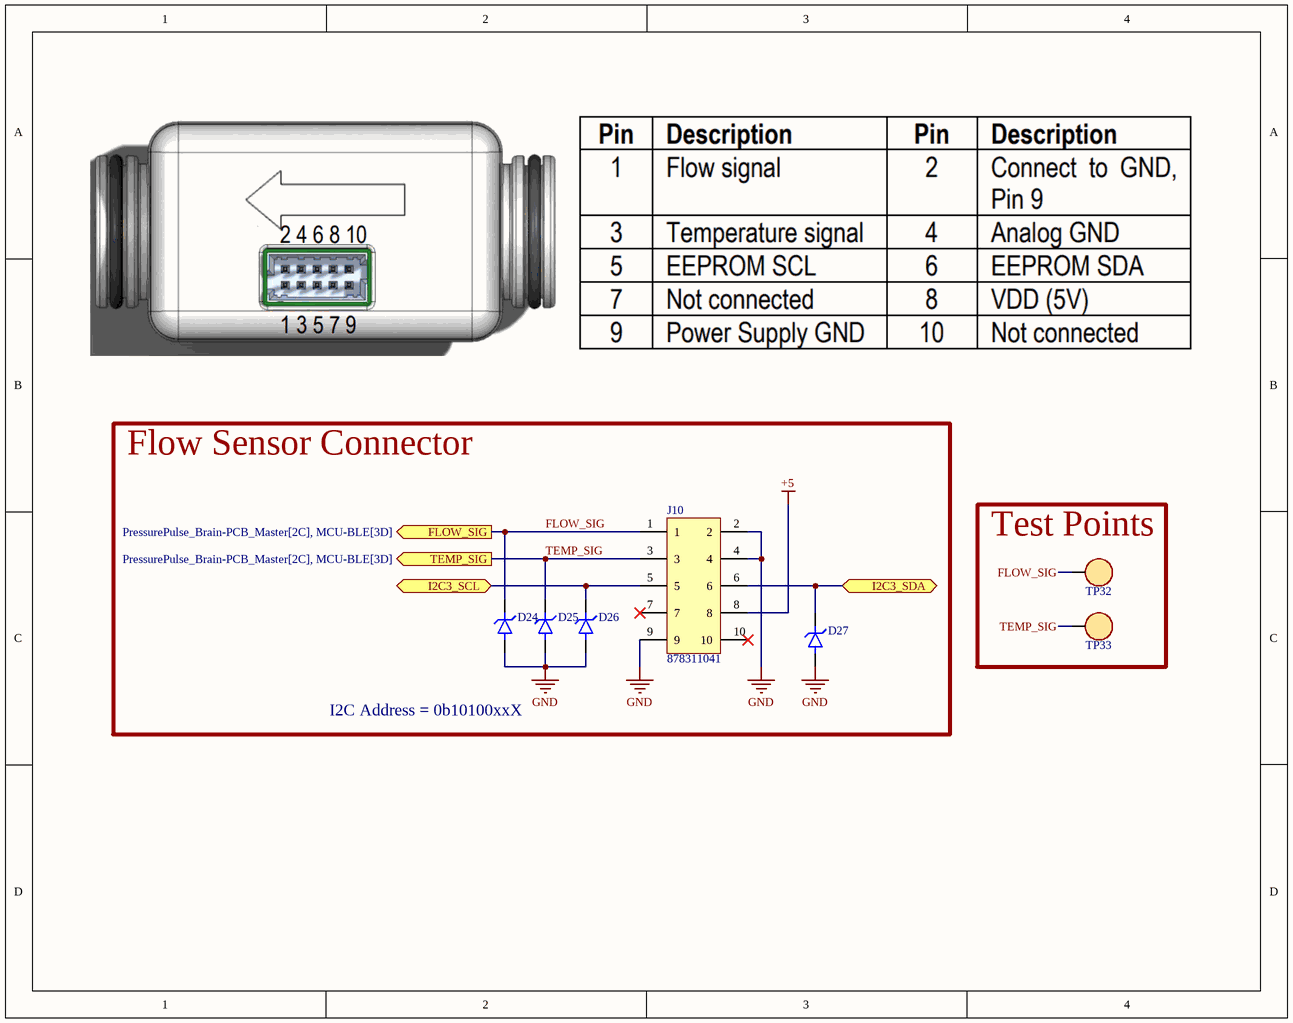
[diagram p5: Flow-Sensor.SchDoc]

### Parts
D24  RCLAMP0521P.TCT  [BDFN2C051V40]  (value not drawn)
D25  RCLAMP0521P.TCT  [BDFN2C051V40]  (value not drawn)
D26  RCLAMP0521P.TCT  [BDFN2C051V40]  (value not drawn)
D27  RCLAMP0521P.TCT  [BDFN2C051V40]  (value not drawn)
J10  878311041  [878311041]
TP32  RH-5019  [TP - RH-5019]  (value not drawn)
TP33  RH-5019  [TP - RH-5019]  (value not drawn)

### Blocks framed on the sheet
Flow Sensor Connector: D24-D27 J10
Test Points: TP32 TP33

### Ports
FLOW_SIG (out, see PressurePulse_Brain-PCB_Master[2C], MCU-BLE[3D]), I2C3_SCL (bidir, see PressurePulse_Brain-PCB_Master[2C], Fuel-Gauge[4B], Gyroscope[1C], MCU-BLE[2D], Pressure-Sensor[1C]), I2C3_SDA (bidir, see PressurePulse_Brain-PCB_Master[2C], Fuel-Gauge[4B], Gyroscope[1C], MCU-BLE[2D], Pressure-Sensor[3C]), TEMP_SIG (out, see PressurePulse_Brain-PCB_Master[2C], MCU-BLE[3D])

### Nets
+5: J10.8
GND: D24.A D25.A D26.A D27.A J10.2 J10.4 J10.9
FLOW_SIG: D24.K J10.1 TP32.1 ; port FLOW_SIG
I2C3_SCL: D26.K J10.5 ; port I2C3_SCL
I2C3_SDA: D27.K J10.6 ; port I2C3_SDA
TEMP_SIG: D25.K J10.3 TP33.1 ; port TEMP_SIG

Not connected (* = marked no-connect by the designer): J10 7* 10*

### Notes on the sheet
- I2C Address = 0b10100xxX

### Library data of the parts
D24-D27 = TVS DIODE: as D6 on sheet SWD; MFR PN: BDFN2C051V40; JLCPCB PN: C152023
J10 = MOLEX 10 POS 2mm TH: MFR: Molex; Value: DNS; MFR PN: 878311041
TP32 TP33 = TEST POINT: MFR: ronghe; MFR PN: RH-5019; Value: RH-5019; JLCPCB PN: C5199800

## Sheet PWR-Switch.SchDoc
size B; SheetNumber: 2; SheetTotal: 17
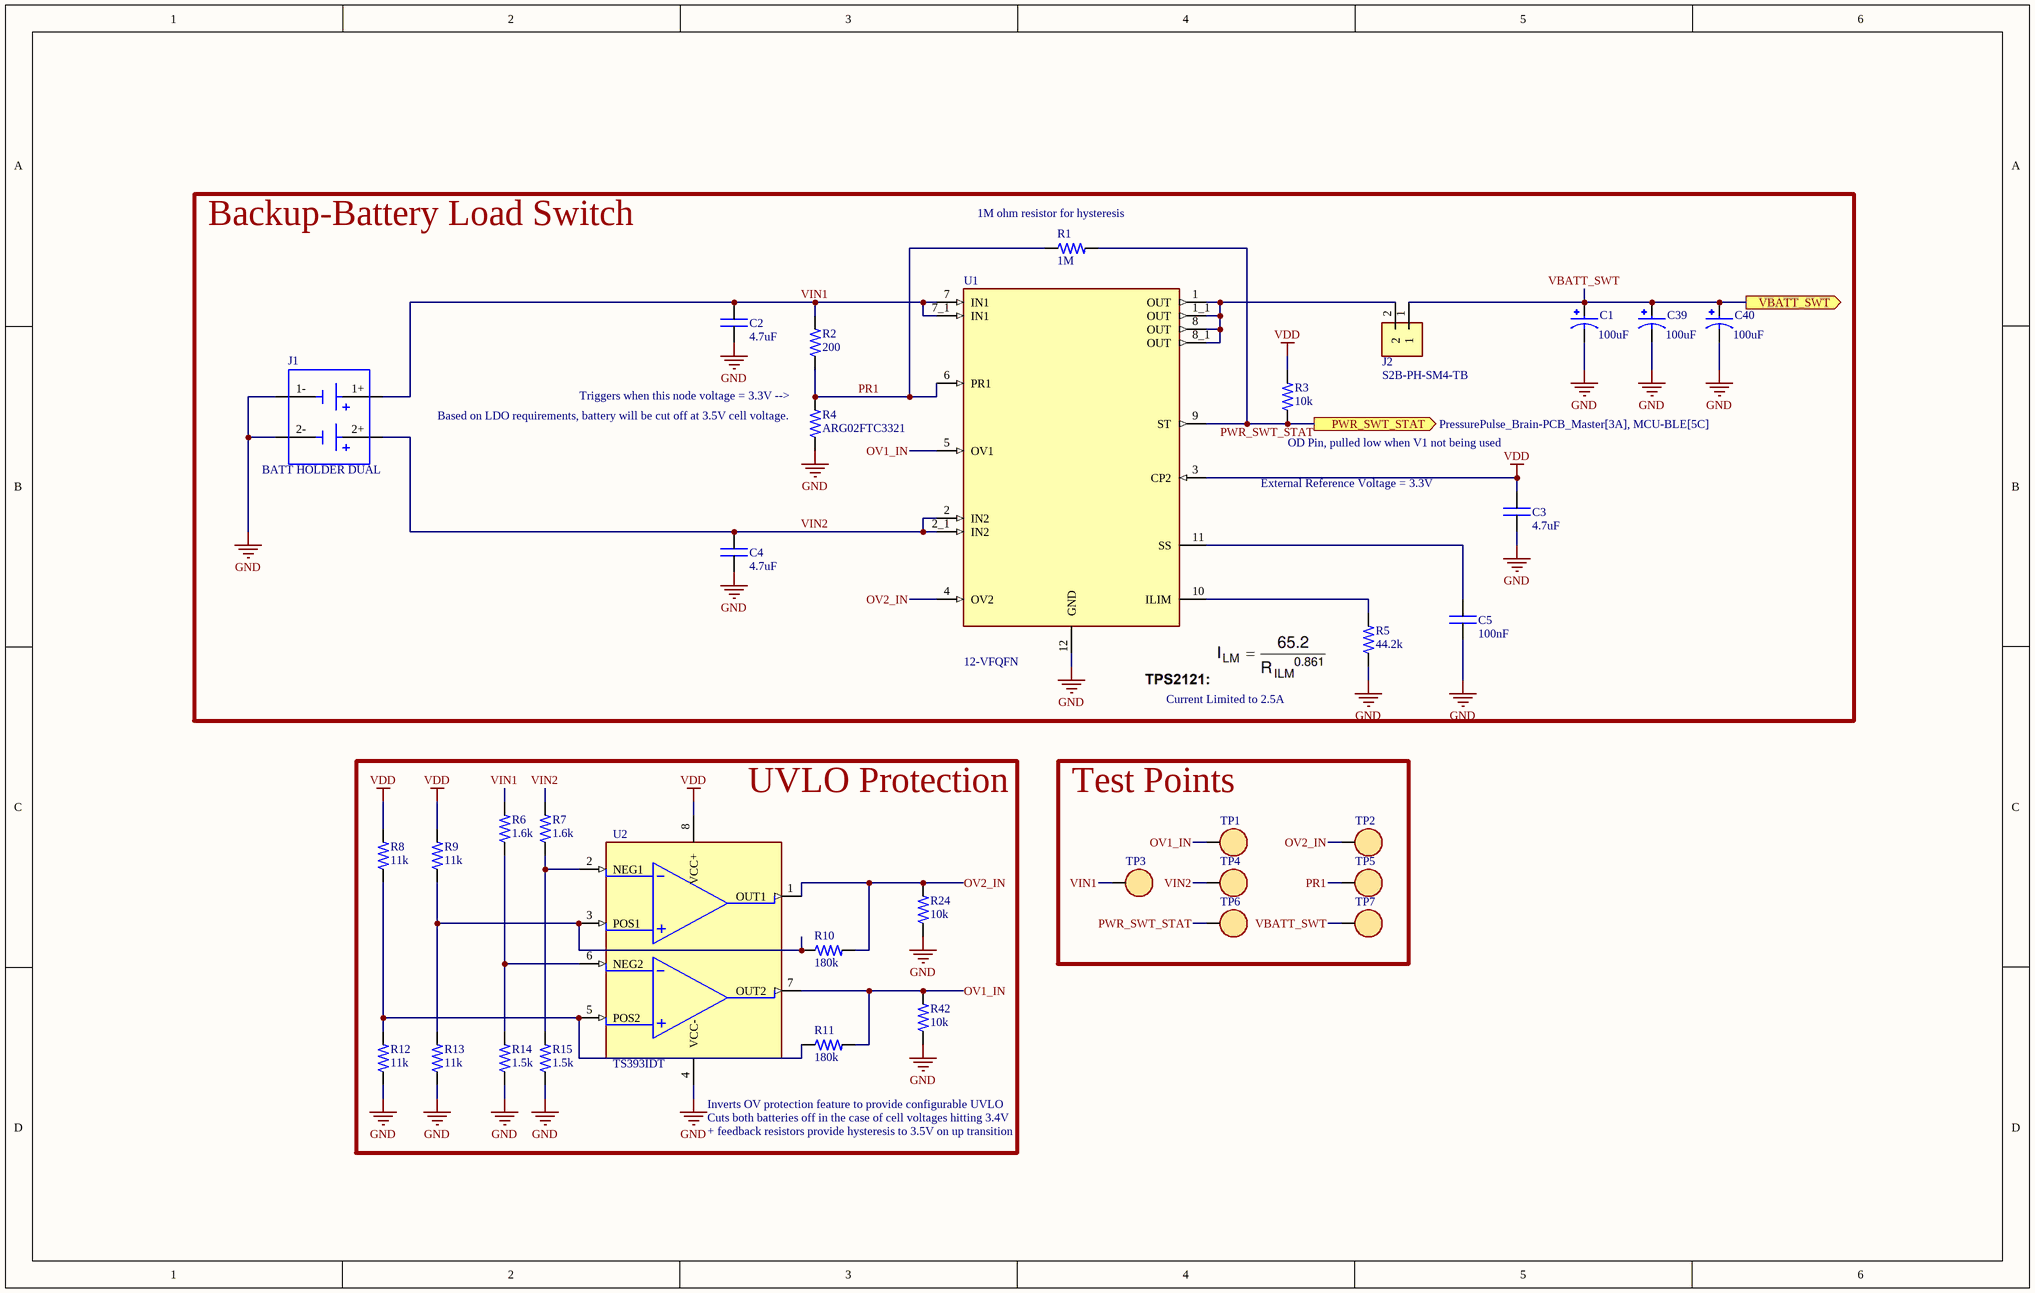
[diagram p6: PWR-Switch.SchDoc]

### Parts
C1  value 100uF  [CAP_POL_SMD]  (hidden comment: CAP POLARIZED)
C2  value 4.7uF  [0402C]  (hidden comment: CAP)
C3  value 4.7uF  [0402C]  (hidden comment: CAP)
C4  value 4.7uF  [0402C]  (hidden comment: CAP)
C5  value 100nF  [0402C]  (hidden comment: CAP)
C39  value 100uF  [CAP_POL_SMD]  (hidden comment: CAP POLARIZED)
C40  value 100uF  [CAP_POL_SMD]  (hidden comment: CAP POLARIZED)
J1  BATT HOLDER DUAL  [18650_DUAL_PARALLEL]
J2  S2B-PH-SM4-TB  [JST_PH-2POS-SMT-RA]
R1  value 1M  [0402R]  (hidden comment: RES)
R2  value 200  [0402R]  (hidden comment: RES)
R3  value 10k  [0402R]  (hidden comment: RES)
R4  value ARG02FTC3321  [0402R]  (hidden comment: RES)
R5  value 44.2k  [0402R]  (hidden comment: RES)
R6  value 1.6k  [0603-RES]  (hidden comment: RES)
R7  value 1.6k  [0603-RES]  (hidden comment: RES)
R8  value 11k  [0402R]  (hidden comment: RES)
R9  value 11k  [0402R]  (hidden comment: RES)
R10  value 180k  [0402R]  (hidden comment: RES)
R11  value 180k  [0402R]  (hidden comment: RES)
R12  value 11k  [0402R]  (hidden comment: RES)
R13  value 11k  [0402R]  (hidden comment: RES)
R14  value 1.5k  [0603-RES]  (hidden comment: RES)
R15  value 1.5k  [0603-RES]  (hidden comment: RES)
R24  value 10k  [0402R]  (hidden comment: RES)
R42  value 10k  [0402R]  (hidden comment: RES)
TP1  RH-5019  [TP - RH-5019]  (value not drawn)
TP2  RH-5019  [TP - RH-5019]  (value not drawn)
TP3  RH-5019  [TP - RH-5019]  (value not drawn)
TP4  RH-5019  [TP - RH-5019]  (value not drawn)
TP5  RH-5019  [TP - RH-5019]  (value not drawn)
TP6  RH-5019  [TP - RH-5019]  (value not drawn)
TP7  RH-5019  [TP - RH-5019]  (value not drawn)
U1  12-VFQFN  [12-VFQFN]
U2  TS393IDT  [SOIC-8]

### Blocks framed on the sheet
Backup-Battery Load Switch: C1-C5 C39 C40 J1 J2 R1-R5 U1
UVLO Protection: R6-R15 R24 R42 U2
Test Points: TP1-TP7

### Ports
PWR_SWT_STAT (out, see PressurePulse_Brain-PCB_Master[3A], MCU-BLE[5C]), VBATT_SWT (out, see PressurePulse_Brain-PCB_Master[3A], Fuel-Gauge[2B])

### Nets
GND: C1.2 C2.1 C3.1 C4.1 C5.1 C39.2 C40.2 J1.1- J1.2- R4.1 R5.1 R12.1 R13.1 R14.1 R15.1 R24.1 R42.1 U1.12(GND) U2.4(VCC-)
VDD: C3.2 R3.2 R8.2 R9.2 U1.3(CP2) U2.8(VCC+)
OV1_IN: R11.2 R42.2 TP1.1 U1.5(OV1) U2.7(OUT2)
OV2_IN: R10.2 R24.2 TP2.1 U1.4(OV2) U2.1(OUT1)
PR1: R1.1 R2.1 R4.2 TP5.1 U1.6(PR1)
PWR_SWT_STAT: R1.2 R3.1 TP6.1 U1.9(ST) ; port PWR_SWT_STAT
VBATT_SWT: C1.1 C39.1 C40.1 J2.1 TP7.1 ; port VBATT_SWT
VIN1: C2.2 J1.1+ R2.2 R6.2 TP3.1 U1.7(IN1) U1.7_1(IN1)
VIN2: C4.2 J1.2+ R7.2 TP4.1 U1.2(IN2) U1.2_1(IN2)
NetC5_2: C5.2 U1.11(SS)
NetJ2_2: J2.2 U1.1(OUT) U1.1_1(OUT) U1.8(OUT) U1.8_1(OUT)
NetR5_2: R5.2 U1.10(ILIM)
NetR6_1: R6.1 R14.2 U2.6(NEG2)
NetR7_1: R7.1 R15.2 U2.2(NEG1)
NetR8_1: R8.1 R11.1 R12.2 U2.5(POS2)
NetR9_1: R9.1 R10.1 R13.2 U2.3(POS1)

### Notes on the sheet
- (near R1) 1M ohm resistor for hysteresis
- (near R4) Based on LDO requirements, battery will be cut off at 3.5V cell voltage.
- (near R4) Triggers when this node voltage = 3.3V -->
- External Reference Voltage = 3.3V
- (near R3) OD Pin, pulled low when V1 not being used
- Current Limited to 2.5A
- Inverts OV protection feature to provide configurable UVLO
- Cuts both batteries off in the case of cell voltages hitting 3.4V
- + feedback resistors provide hysteresis to 3.5V on up transition

### Library data of the parts
C1 C39 C40 = CAP POLARIZED: MFR: PANASONIC; MFR PN: EEEHA1E101P; JLCPCB PN: C336392
C2-C4 = CAP: Capacitor; MFR: *; MFR PN: *; JLCPCB PN: *; Footprint: *
C5 = CAP: Capaicitor; MFR: *; MFR PN: *
J1 = BATT HOLDER DUAL: Battery Holder (Open) 18650 2 Cell PC Pin; MFR: MPD (Memory Protection Devices); MFR PN: BK-18650-PC4; Value: DNS; JLCPCB PN: *
J2 = JST CONN 2POS PH: Connector Header Surface Mount, Right Angle 2 position 0.079 (2.00mm); MFR PN: S2B-PH-SM4-TB(LF)(SN); MFR: JST Sales; Type: SMD; Value: S2B-PH-SM4-TB; JLCPCB PN: C295747
R1 R3 R10 R11 R24 R42 = RES: Resistor; MFR PN: *; MFR: *
  R1: JLCPCB PN: C2991630
  R3 R24 R42: JLCPCB PN: C843837
  R10 R11: JLCPCB PN: C237748
R2 R6-R9 R12-R15 = RES: Resistor; Tolerance: 0.5%; MFR PN: *; MFR: *
  R2: JLCPCB PN: C784580
  R6 R7: JLCPCB PN: C423071
  R8 R9 R12 R13: JLCPCB PN: C319901
  R14 R15: JLCPCB PN: C319982
R4 R5 = RES: Resistor; Tolerance: 1%; MFR PN: *; MFR: *
  R4: JLCPCB PN: C284517
  R5: JLCPCB PN: C25895
TP1-TP7 = TEST POINT: MFR: ronghe; MFR PN: RH-5019; Value: RH-5019; JLCPCB PN: C5199800
U1 = TPS2121RUXR: 2.7-V to 22-V, 56-ma, 4.5-A, power mux with seamless switchover; MFR: Texas Instruments; Value: TPS2121RUXR; MFR PN: TPS2121RUXR; JLCPCB PN: C485916
U2 = DUAL COMPARATOR: Micropower dual CMOS voltage comparators; MFR: STMicroelectronics; MFR PN: TS393IDT; Value: TS393IDT; JLCPCB PN: C7106

## Sheet Fuel-Gauge.SchDoc
size B; SheetNumber: 3; SheetTotal: 17
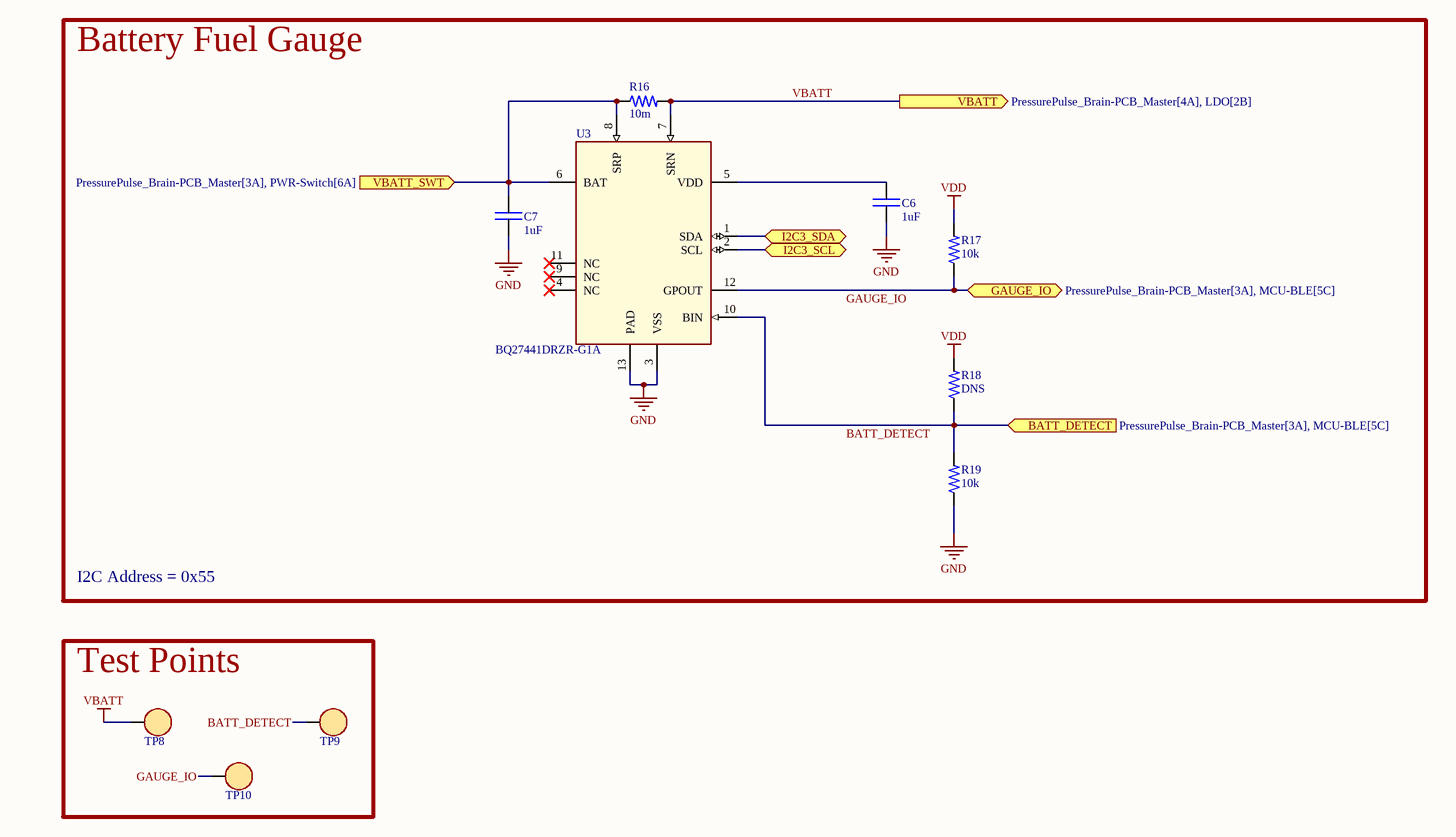
[diagram p7: Fuel-Gauge.SchDoc]

### Parts
C6  value 1uF  [0402C]  (hidden comment: CAP)
C7  value 1uF  [0402C]  (hidden comment: CAP)
R16  value 10m  [2512R]  (hidden comment: RES - CURRENT SENSE)
R17  value 10k  [0402R]  (hidden comment: RES)
R18  value DNS  [0402R]  (hidden comment: RES)
R19  value 10k  [0402R]  (hidden comment: RES)
TP8  RH-5019  [TP - RH-5019]  (value not drawn)
TP9  RH-5019  [TP - RH-5019]  (value not drawn)
TP10  RH-5019  [TP - RH-5019]  (value not drawn)
U3  BQ27441DRZR-G1A  [bq27441-G1]

### Blocks framed on the sheet
Battery Fuel Gauge: C6 C7 R16-R19 U3
Test Points: TP8-TP10

### Ports
BATT_DETECT (in, see PressurePulse_Brain-PCB_Master[3A], MCU-BLE[5C]), GAUGE_IO (bidir, see PressurePulse_Brain-PCB_Master[3A], MCU-BLE[5C]), I2C3_SCL (bidir, see PressurePulse_Brain-PCB_Master[4A], Flow-Sensor[2C], Gyroscope[1C], MCU-BLE[2D], Pressure-Sensor[1C]), I2C3_SDA (bidir, see PressurePulse_Brain-PCB_Master[4A], Flow-Sensor[3C], Gyroscope[1C], MCU-BLE[2D], Pressure-Sensor[3C]), VBATT (out, see PressurePulse_Brain-PCB_Master[4A], LDO[2B]), VBATT_SWT (in, see PressurePulse_Brain-PCB_Master[3A], PWR-Switch[6A])

### Nets
GND: C6.1 C7.1 R19.1 U3.3(VSS) U3.13(PAD)
VBATT: R16.2 TP8.1 U3.7(SRN) ; port VBATT
VDD: R17.2 R18.2
BATT_DETECT: R18.1 R19.2 TP9.1 U3.10(BIN) ; port BATT_DETECT
GAUGE_IO: R17.1 TP10.1 U3.12(GPOUT) ; port GAUGE_IO
I2C3_SCL: U3.2(SCL) ; port I2C3_SCL
I2C3_SDA: U3.1(SDA) ; port I2C3_SDA
VBATT_SWT: C7.2 R16.1 U3.6(BAT) U3.8(SRP) ; port VBATT_SWT
NetC6_2: C6.2 U3.5(VDD)

Not connected (* = marked no-connect by the designer): U3 4(NC)* 9(NC)* 11(NC)*

### Notes on the sheet
- I2C Address = 0x55

### Library data of the parts
C6 C7 = CAP: Capacitor; MFR: *; MFR PN: *; JLCPCB PN: *; Footprint: *
R16 = RES - CURRENT SENSE: 3W 10m Ohm Current Sense Resistor; Tolerance: 1%; MFR PN: *; MFR: *; JLCPCB PN: C429515
R17-R19 = RES: Resistor; MFR PN: *; MFR: *
  R17 R19: JLCPCB PN: C843837
  R18: JLCPCB PN: *
TP8-TP10 = TEST POINT: MFR: ronghe; MFR PN: RH-5019; Value: RH-5019; JLCPCB PN: C5199800
U3 = BATT FUEL GAUGE: No Description Available; MFR: Texas Instruments; Value: BQ27441DRZR-G1A; JLCPCB PN: C473397; MFR PN: BQ27441DRZR-G1A

## Sheet LDO.SchDoc
size A; SheetNumber: 4; SheetTotal: 17
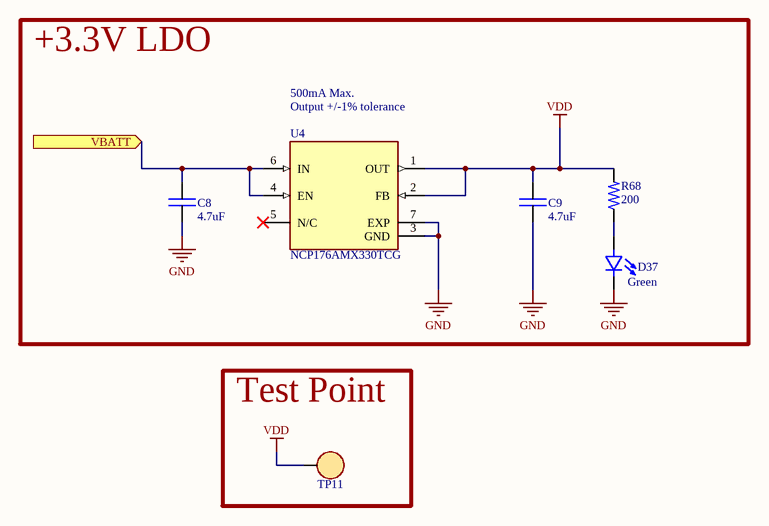
[diagram p8: LDO.SchDoc]

### Parts
C8  value 4.7uF  [0402C]  (hidden comment: CAP)
C9  value 4.7uF  [0402C]  (hidden comment: CAP)
D37  Color: Green  [0603-LED]  (hidden comment: LED - single)
R68  value 200  [0402R]  (hidden comment: RES)
TP11  RH-5019  [TP - RH-5019]  (value not drawn)
U4  NCP176AMX330TCG  [6-XDFN]

### Blocks framed on the sheet
+3.3V LDO: C8 C9 D37 R68 U4
Test Point: TP11

### Ports
VBATT (in, see PressurePulse_Brain-PCB_Master[4A], Fuel-Gauge[4B])

### Nets
GND: C8.1 C9.1 D37.2(C) U4.3(GND) U4.7(EXP)
VBATT: C8.2 U4.4(EN) U4.6(IN) ; port VBATT
VDD: C9.2 R68.2 TP11.1 U4.1(OUT) U4.2(FB)
NetD37_1: D37.1(A) R68.1

Not connected (* = marked no-connect by the designer): U4 5(N/C)*

### Notes on the sheet
- 500mA Max.
- Output +/-1% tolerance

### Library data of the parts
C8 C9 = CAP: Capacitor; MFR: *; MFR PN: *; JLCPCB PN: *; Footprint: *
D37 = LED - single: LED; Value: SZYY0603YG; MFR: *; MFR PN: *; JLCPCB PN: C434423
R68 = RES: Resistor; MFR PN: *; MFR: *; Type: SMD
TP11 = TEST POINT: MFR: ronghe; MFR PN: RH-5019; Value: RH-5019; JLCPCB PN: C5199800
U4 = LDO 3.3V: LDO REGULATOR; MFR: onsemi; MFR PN: NCP176AMX330TCG; Value: NCP176AMX330TCG; JLCPCB PN: C233363

## Sheet Boost.SchDoc
size A; SheetNumber: 5; SheetTotal: 17
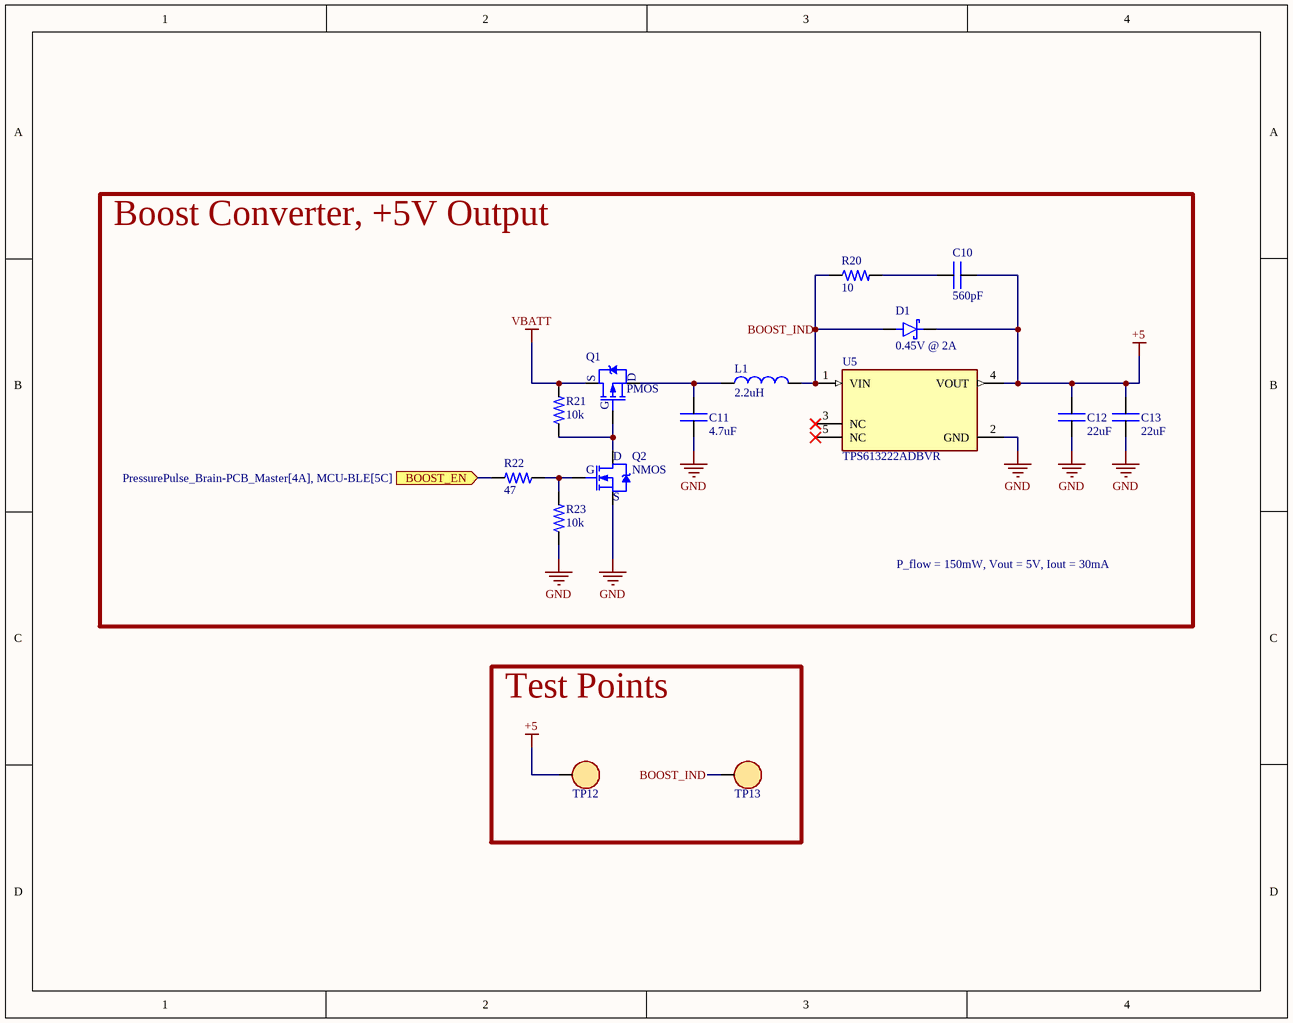
[diagram p9: Boost.SchDoc]

### Parts
C10  value 560pF  [0805C]  (hidden comment: CAP)
C11  value 4.7uF  [0402C]  (hidden comment: CAP)
C12  value 22uF  [0805C]  (hidden comment: CAP)
C13  value 22uF  [0805C]  (hidden comment: CAP)
D1  0.45V @ 2A  [SMAF]
L1  value 2.2uH  [0805L]  (hidden comment: IND)
Q1  PMOS  [SOT-23]
Q2  NMOS  [SOT-23]
R20  value 10  [2512R]  (hidden comment: RES)
R21  value 10k  [0402R]  (hidden comment: RES)
R22  value 47  [0402R]  (hidden comment: RES)
R23  value 10k  [0402R]  (hidden comment: RES)
TP12  RH-5019  [TP - RH-5019]  (value not drawn)
TP13  RH-5019  [TP - RH-5019]  (value not drawn)
U5  TPS613222ADBVR  [SOT-23-5]

### Blocks framed on the sheet
Boost Converter, +5V Output: C10-C13 D1 L1 Q1 Q2 R20-R23 U5
Test Points: TP12 TP13

### Ports
BOOST_EN (in, see PressurePulse_Brain-PCB_Master[4A], MCU-BLE[5C])

### Nets
+5: C10.2 C12.2 C13.2 D1.K TP12.1 U5.4(VOUT)
GND: C11.1 C12.1 C13.1 Q2.S R23.1 U5.2(GND)
VBATT: Q1.S R21.2
BOOST_IND: D1.A L1.2 R20.1 TP13.1 U5.1(VIN)
NetC10_1: C10.1 R20.2
NetC11_2: C11.2 L1.1 Q1.D
NetQ1_G: Q1.G Q2.D R21.1
NetQ2_G: Q2.G R22.1 R23.2
NetR22_2: R22.2 ; port BOOST_EN

Not connected (* = marked no-connect by the designer): U5 3(NC)* 5(NC)*

### Notes on the sheet
- P_flow = 150mW, Vout = 5V, Iout = 30mA

### Library data of the parts
C10 C11 = CAP: Capacitor; Footprint: *
  C10: MFR: *; MFR PN: *; JLCPCB PN: C5186812
C12 C13 = CAP: Capacitor; MFR: Samsung Electro-Mechanics; MFR PN: CL21A226MAQNNNE; JLCPCB PN: C45783; Footprint: *
D1 = SCHOTTKY DIODE: MFR: Shandong Jingdao Microelectronics; MFR PN: SSL24F; Value: SSL24F; JLCPCB PN: C4749014
L1 = IND: INDUCTOR; MFR: Sunlord; MFR PN: WPN201610U2R2MT; JLCPCB PN: C71386; Footprint: *
Q1 = PMOS: P-Channel MOSFET; MFR: Diodes Incorporated; Value: PPMT12V4; Footprint: *; JLCPCB PN: C110724
Q2 = NMOS: as Q3 on sheet MCU-BLE; MFR PN: IRLML0100TRPBF; JLCPCB PN: C53658
R20-R23 = RES: Resistor; MFR PN: *; MFR: *
  R20: JLCPCB PN: C3013385
  R21 R23: JLCPCB PN: C843837
  R22: JLCPCB PN: *
TP12 TP13 = TEST POINT: MFR: ronghe; MFR PN: RH-5019; Value: RH-5019; JLCPCB PN: C5199800
U5 = BOOST 3.3V-5V FIXED: 6-uA Quiescent Current, 1.8-A Switch Current Boost Converter 5-SOT-23 -40 to 85; MFR: Texas Instruments; MFR PN: TPS613222ADBVR; Value: TPS613222ADBVR; JLCPCB PN: C2071163

## Sheet Magnetic-Charger.SchDoc
size A; SheetNumber: 14; SheetTotal: 17
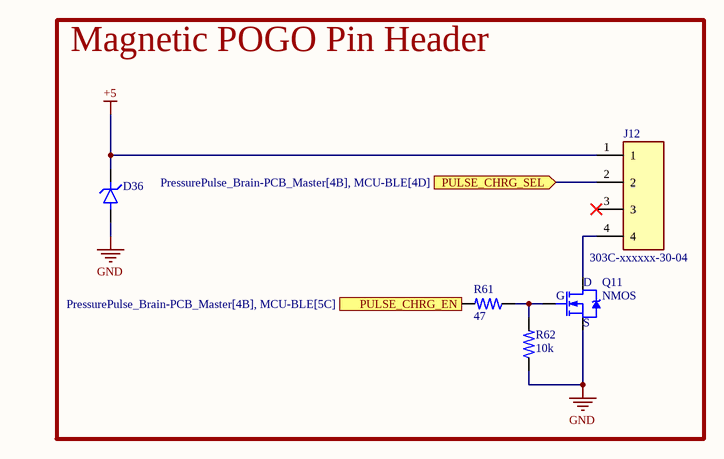
[diagram p10: Magnetic-Charger.SchDoc]

### Parts
D36  RCLAMP0521P.TCT  [BDFN2C051V40]  (value not drawn)
J12  303C-xxxxxx-30-04  [MAG POGO - 4 POS MALE]
Q11  NMOS  [SOT-23]
R61  value 47  [0402R]  (hidden comment: RES)
R62  value 10k  [0402R]  (hidden comment: RES)

### Blocks framed on the sheet
Magnetic POGO Pin Header: D36 J12 Q11 R61 R62

### Ports
PULSE_CHRG_EN (in, see PressurePulse_Brain-PCB_Master[4B], MCU-BLE[5C]), PULSE_CHRG_SEL (in, see PressurePulse_Brain-PCB_Master[4B], MCU-BLE[4D])

### Nets
+5: D36.K J12.1
GND: D36.A Q11.S R62.1
NetJ12_2: J12.2 ; port PULSE_CHRG_SEL
NetJ12_4: J12.4 Q11.D
NetQ11_G: Q11.G R61.1 R62.2
NetR61_2: R61.2 ; port PULSE_CHRG_EN

Not connected (* = marked no-connect by the designer): J12 3*

### Library data of the parts
D36 = TVS DIODE: as D6 on sheet SWD; MFR PN: BDFN2C051V40; JLCPCB PN: C152023
J12 = 303C-xxxxxx-30-04: MAGNETIC POGO 4POS; MFR: ATTEND Technology; MFR PN: 303C-321018-30-04; Value: DNS; JLCPCB PN: *
Q11 = NMOS: as Q3 on sheet MCU-BLE; MFR PN: IRLML0100TRPBF; JLCPCB PN: C53658
R61 R62 = RES: Resistor; MFR PN: *; MFR: *
  R61: JLCPCB PN: *
  R62: JLCPCB PN: C843837

## Sheet SD-Socket.SchDoc
size B; SheetNumber: 9; SheetTotal: 17
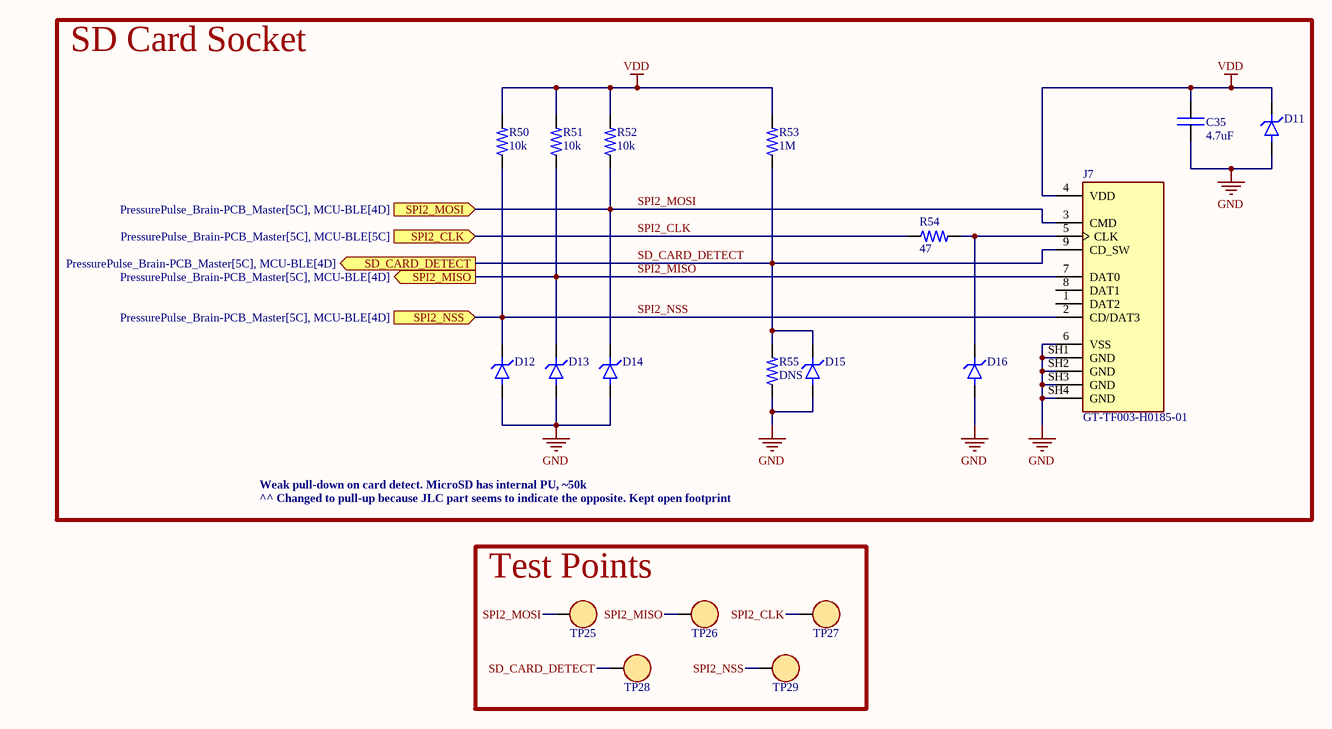
[diagram p11: SD-Socket.SchDoc]

### Parts
C35  value 4.7uF  [0402C]  (hidden comment: CAP)
D11  RCLAMP0521P.TCT  [BDFN2C051V40]  (value not drawn)
D12  RCLAMP0521P.TCT  [BDFN2C051V40]  (value not drawn)
D13  RCLAMP0521P.TCT  [BDFN2C051V40]  (value not drawn)
D14  RCLAMP0521P.TCT  [BDFN2C051V40]  (value not drawn)
D15  RCLAMP0521P.TCT  [BDFN2C051V40]  (value not drawn)
D16  RCLAMP0521P.TCT  [BDFN2C051V40]  (value not drawn)
J7  GT-TF003-H0185-01  [GTTF003H018501]
R50  value 10k  [0402R]  (hidden comment: RES)
R51  value 10k  [0402R]  (hidden comment: RES)
R52  value 10k  [0402R]  (hidden comment: RES)
R53  value 1M  [0402R]  (hidden comment: RES)
R54  value 47  [0402R]  (hidden comment: RES)
R55  value DNS  [0402R]  (hidden comment: RES)
TP25  RH-5019  [TP - RH-5019]  (value not drawn)
TP26  RH-5019  [TP - RH-5019]  (value not drawn)
TP27  RH-5019  [TP - RH-5019]  (value not drawn)
TP28  RH-5019  [TP - RH-5019]  (value not drawn)
TP29  RH-5019  [TP - RH-5019]  (value not drawn)

### Blocks framed on the sheet
SD Card Socket: C35 D11-D16 J7 R50-R55
Test Points: TP25-TP29

### Ports
SD_CARD_DETECT (out, see PressurePulse_Brain-PCB_Master[5C], MCU-BLE[4D]), SPI2_CLK (in, see PressurePulse_Brain-PCB_Master[5C], MCU-BLE[5C]), SPI2_MISO (out, see PressurePulse_Brain-PCB_Master[5C], MCU-BLE[4D]), SPI2_MOSI (in, see PressurePulse_Brain-PCB_Master[5C], MCU-BLE[4D]), SPI2_NSS (in, see PressurePulse_Brain-PCB_Master[5C], MCU-BLE[4D])

### Nets
GND: C35.1 D11.A D12.A D13.A D14.A D15.A D16.A J7.6(VSS) J7.SH1(GND) J7.SH2(GND) J7.SH3(GND) J7.SH4(GND) R55.1
VDD: C35.2 D11.K J7.4(VDD) R50.2 R51.2 R52.2 R53.2
SD_CARD_DETECT: D15.K J7.9(CD_SW) R53.1 R55.2 TP28.1 ; port SD_CARD_DETECT
SPI2_CLK: R54.1 TP27.1 ; port SPI2_CLK
SPI2_MISO: D13.K J7.7(DAT0) R51.1 TP26.1 ; port SPI2_MISO
SPI2_MOSI: D14.K J7.3(CMD) R52.1 TP25.1 ; port SPI2_MOSI
SPI2_NSS: D12.K J7.2(CD/DAT3) R50.1 TP29.1 ; port SPI2_NSS
NetD16_K: D16.K J7.5(CLK) R54.2

Not connected (* = marked no-connect by the designer): J7 1(DAT2) 8(DAT1)

### Notes on the sheet
- Weak pull-down on card detect. MicroSD has internal PU, ~50k
- ^^ Changed to pull-up because JLC part seems to indicate the opposite. Kept open footprint

### Library data of the parts
C35 = CAP: Capacitor; MFR: *; MFR PN: *; JLCPCB PN: *; Footprint: *
D11-D16 = TVS DIODE: as D6 on sheet SWD; MFR PN: BDFN2C051V40; JLCPCB PN: C152023
J7 = SD-CONN-SMD_JLC: MFR: G-Switch; MFR PN: GT-TF003-H0185-01; Type: SMD; Value: GT-TF003-H0185-01
R50-R55 = RES: Resistor; MFR PN: *; MFR: *
  R50-R52: JLCPCB PN: C843837
  R53: JLCPCB PN: C2991630
  R54 R55: JLCPCB PN: *
TP25-TP29 = TEST POINT: MFR: ronghe; MFR PN: RH-5019; Value: RH-5019; JLCPCB PN: C5199800

## Sheet TFT-Display.SchDoc
size B; SheetNumber: 13; SheetTotal: 17
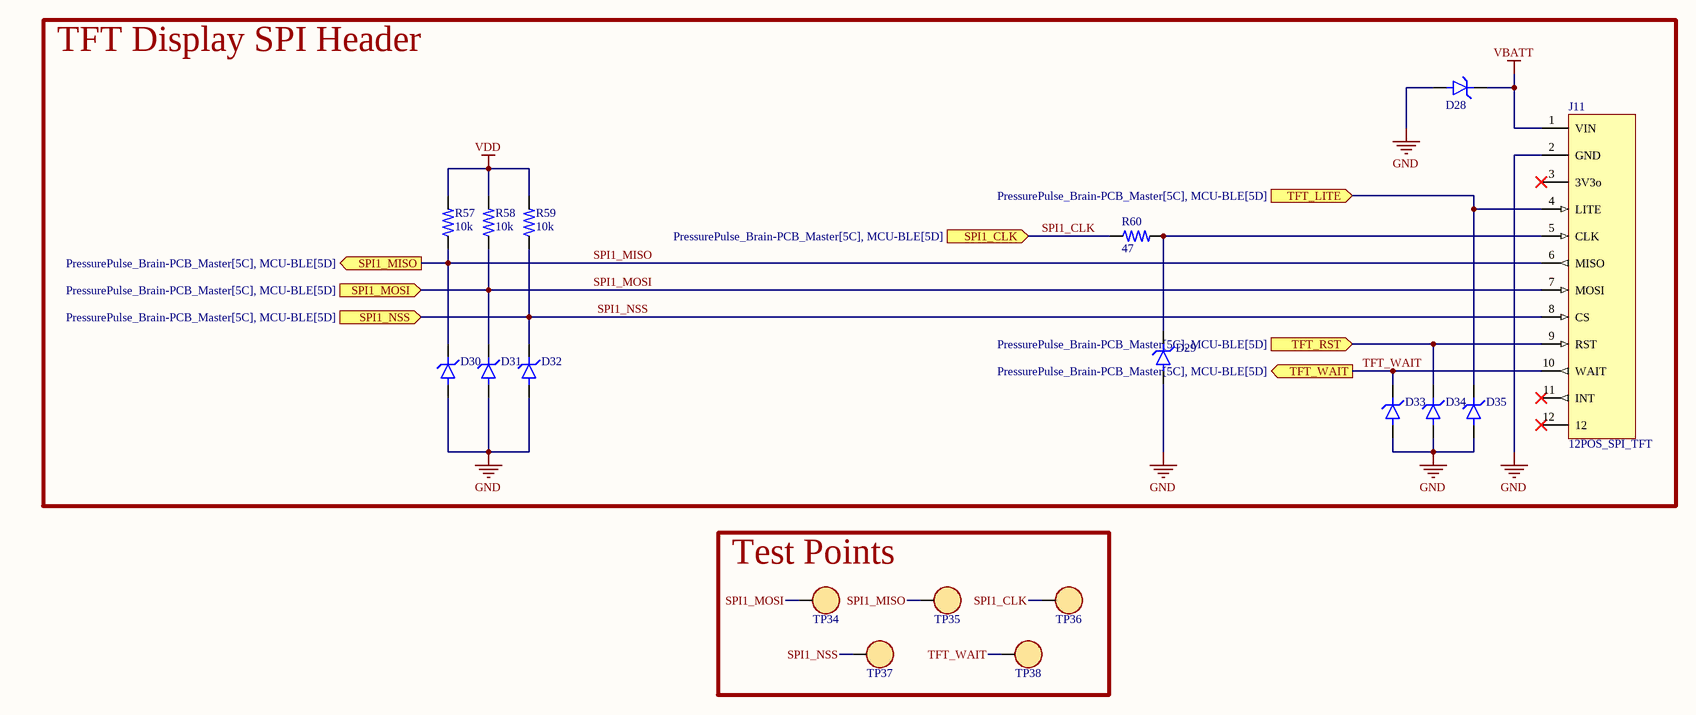
[diagram p12: TFT-Display.SchDoc]

### Parts
D28  RCLAMP0521P.TCT  [BDFN2C051V40]  (value not drawn)
D29  RCLAMP0521P.TCT  [BDFN2C051V40]  (value not drawn)
D30  RCLAMP0521P.TCT  [BDFN2C051V40]  (value not drawn)
D31  RCLAMP0521P.TCT  [BDFN2C051V40]  (value not drawn)
D32  RCLAMP0521P.TCT  [BDFN2C051V40]  (value not drawn)
D33  RCLAMP0521P.TCT  [BDFN2C051V40]  (value not drawn)
D34  RCLAMP0521P.TCT  [BDFN2C051V40]  (value not drawn)
D35  RCLAMP0521P.TCT  [BDFN2C051V40]  (value not drawn)
J11  12POS_SPI_TFT  [2.54MM-12POS_TFT]
R57  value 10k  [0402R]  (hidden comment: RES)
R58  value 10k  [0402R]  (hidden comment: RES)
R59  value 10k  [0402R]  (hidden comment: RES)
R60  value 47  [0402R]  (hidden comment: RES)
TP34  RH-5019  [TP - RH-5019]  (value not drawn)
TP35  RH-5019  [TP - RH-5019]  (value not drawn)
TP36  RH-5019  [TP - RH-5019]  (value not drawn)
TP37  RH-5019  [TP - RH-5019]  (value not drawn)
TP38  RH-5019  [TP - RH-5019]  (value not drawn)

### Blocks framed on the sheet
TFT Display SPI Header: D28-D35 J11 R57-R60
Test Points: TP34-TP38

### Ports
SPI1_CLK (in, see PressurePulse_Brain-PCB_Master[5C], MCU-BLE[5D]), SPI1_MISO (out, see PressurePulse_Brain-PCB_Master[5C], MCU-BLE[5D]), SPI1_MOSI (in, see PressurePulse_Brain-PCB_Master[5C], MCU-BLE[5D]), SPI1_NSS (in, see PressurePulse_Brain-PCB_Master[5C], MCU-BLE[5D]), TFT_LITE (in, see PressurePulse_Brain-PCB_Master[5C], MCU-BLE[5D]), TFT_RST (in, see PressurePulse_Brain-PCB_Master[5C], MCU-BLE[5D]), TFT_WAIT (out, see PressurePulse_Brain-PCB_Master[5C], MCU-BLE[5D])

### Nets
GND: D28.A D29.A D30.A D31.A D32.A D33.A D34.A D35.A J11.2(GND)
VBATT: D28.K J11.1(VIN)
VDD: R57.2 R58.2 R59.2
SPI1_CLK: R60.1 TP36.1 ; port SPI1_CLK
SPI1_MISO: D30.K J11.6(MISO) R57.1 TP35.1 ; port SPI1_MISO
SPI1_MOSI: D31.K J11.7(MOSI) R58.1 TP34.1 ; port SPI1_MOSI
SPI1_NSS: D32.K J11.8(CS) R59.1 TP37.1 ; port SPI1_NSS
TFT_WAIT: D33.K J11.10(WAIT) TP38.1 ; port TFT_WAIT
NetD29_K: D29.K J11.5(CLK) R60.2
NetD34_K: D34.K J11.9(RST) ; port TFT_RST
NetD35_K: D35.K J11.4(LITE) ; port TFT_LITE

Not connected (* = marked no-connect by the designer): J11 3(3V3o)* 11(INT)* 12*

### Library data of the parts
D28-D35 = TVS DIODE: as D6 on sheet SWD; MFR PN: BDFN2C051V40; JLCPCB PN: C152023
J11 = 12POS_SPI_TFT: Value: DNS; MFR: *; MFR PN: *; JLCPCB PN: *
R57-R60 = RES: Resistor; MFR PN: *; MFR: *
  R57-R59: JLCPCB PN: C843837
  R60: JLCPCB PN: *
TP34-TP38 = TEST POINT: MFR: ronghe; MFR PN: RH-5019; Value: RH-5019; JLCPCB PN: C5199800

## Sheet Amplifier.SchDoc
size B; SheetNumber: 8; SheetTotal: 17
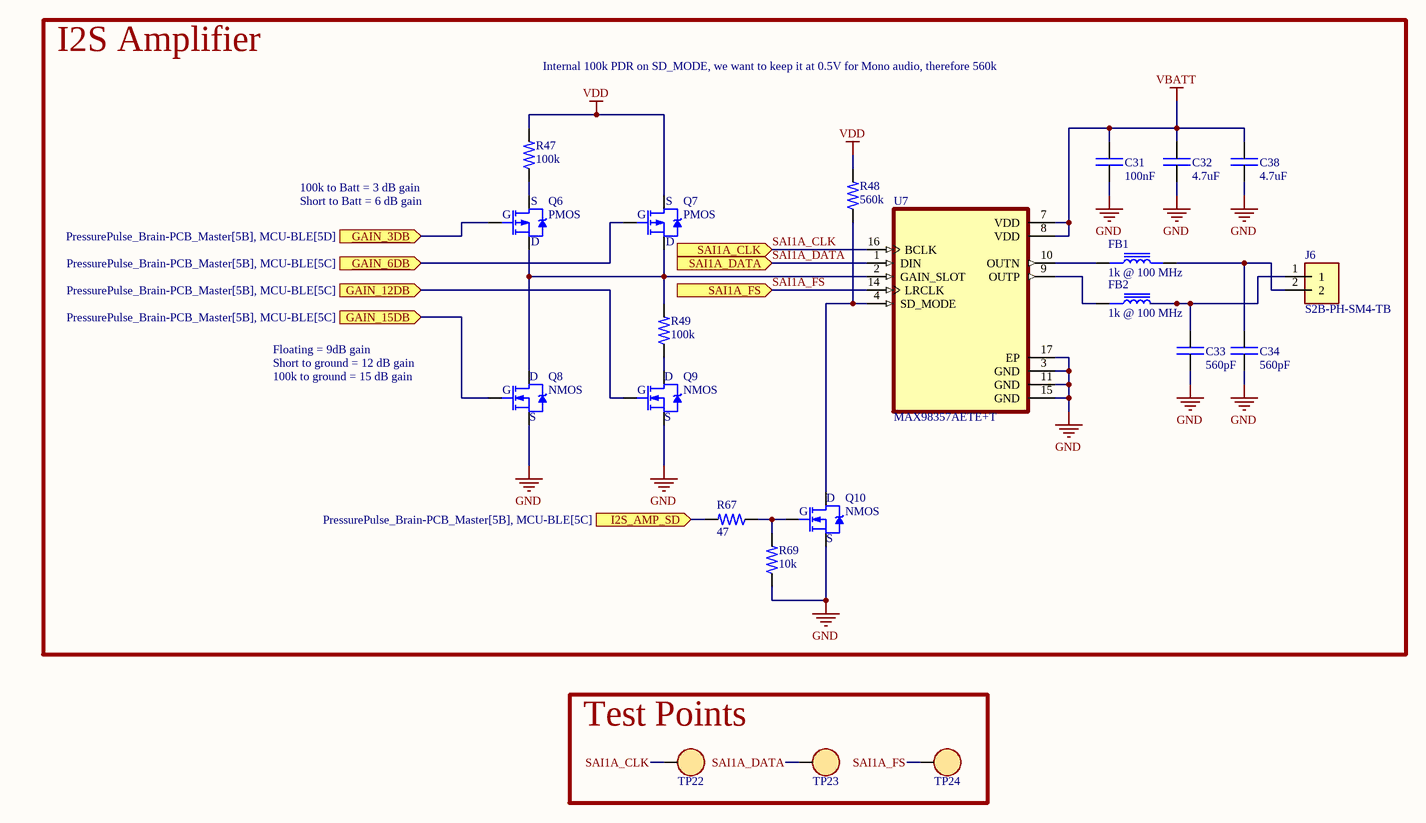
[diagram p13: Amplifier.SchDoc]

### Parts
C31  value 100nF  [0402C]  (hidden comment: CAP)
C32  value 4.7uF  [0402C]  (hidden comment: CAP)
C33  value 560pF  [0402C]  (hidden comment: CAP)
C34  value 560pF  [0402C]  (hidden comment: CAP)
C38  value 4.7uF  [0402C]  (hidden comment: CAP)
FB1  1k @ 100 MHz  [0603L]
FB2  1k @ 100 MHz  [0603L]
J6  S2B-PH-SM4-TB  [JST_PH-2POS-SMT-RA]
Q6  PMOS  [SOT-23]
Q7  PMOS  [SOT-23]
Q8  NMOS  [SOT-23]
Q9  NMOS  [SOT-23]
Q10  NMOS  [SOT-23]
R47  value 100k  [0402R]  (hidden comment: RES)
R48  value 560k  [0402R]  (hidden comment: RES)
R49  value 100k  [0402R]  (hidden comment: RES)
R67  value 47  [0402R]  (hidden comment: RES)
R69  value 10k  [0402R]  (hidden comment: RES)
TP22  RH-5019  [TP - RH-5019]  (value not drawn)
TP23  RH-5019  [TP - RH-5019]  (value not drawn)
TP24  RH-5019  [TP - RH-5019]  (value not drawn)
U7  MAX98357AETE+T  [16-WFQFN EXPOSED PAD]

### Blocks framed on the sheet
I2S Amplifier: C31-C34 C38 FB1 FB2 J6 Q6-Q10 R47-R49 R67 R69 U7
Test Points: TP22-TP24

### Ports
GAIN_3DB (in, see PressurePulse_Brain-PCB_Master[5B], MCU-BLE[5D]), GAIN_6DB (in, see PressurePulse_Brain-PCB_Master[5B], MCU-BLE[5C]), GAIN_12DB (in, see PressurePulse_Brain-PCB_Master[5B], MCU-BLE[5C]), GAIN_15DB (in, see PressurePulse_Brain-PCB_Master[5B], MCU-BLE[5C]), I2S_AMP_SD (in, see PressurePulse_Brain-PCB_Master[5B], MCU-BLE[5C]), SAI1A_CLK (in, see PressurePulse_Brain-PCB_Master[5B], MCU-BLE[5C]), SAI1A_DATA (in, see PressurePulse_Brain-PCB_Master[5B], MCU-BLE[5C]), SAI1A_FS (in, see PressurePulse_Brain-PCB_Master[5B], MCU-BLE[5C])

### Nets
GND: C31.2 C32.1 C33.1 C34.1 C38.1 Q8.S Q9.S Q10.S R69.1 U7.3(GND) U7.11(GND) U7.15(GND) U7.17(EP)
VBATT: C31.1 C32.2 C38.2 U7.7(VDD) U7.8(VDD)
VDD: Q7.S R47.2 R48.2
SAI1A_CLK: TP22.1 U7.16(BCLK) ; port SAI1A_CLK
SAI1A_DATA: TP23.1 U7.1(DIN) ; port SAI1A_DATA
SAI1A_FS: TP24.1 U7.14(LRCLK) ; port SAI1A_FS
NetC33_2: C33.2 FB2.2 J6.1
NetC34_2: C34.2 FB1.2 J6.2
NetFB1_1: FB1.1 U7.10(OUTN)
NetFB2_1: FB2.1 U7.9(OUTP)
NetQ6_D: Q6.D Q7.D Q8.D R49.2 U7.2(GAIN_SLOT)
NetQ6_G: Q6.G ; port GAIN_3DB
NetQ6_S: Q6.S R47.1
NetQ7_G: Q7.G ; port GAIN_6DB
NetQ8_G: Q8.G ; port GAIN_15DB
NetQ9_D: Q9.D R49.1
NetQ9_G: Q9.G ; port GAIN_12DB
NetQ10_D: Q10.D R48.1 U7.4(SD_MODE)
NetQ10_G: Q10.G R67.1 R69.2
NetR67_2: R67.2 ; port I2S_AMP_SD

### Notes on the sheet
- Internal 100k PDR on SD_MODE, we want to keep it at 0.5V for Mono audio, therefore 560k
- 100k to Batt = 3 dB gain
- (near Q6) Short to Batt = 6 dB gain
- Floating = 9dB gain
- 100k to ground = 15 dB gain
- Short to ground = 12 dB gain

### Library data of the parts
C31-C34 C38 = CAP: Capacitor; MFR: *; MFR PN: *; JLCPCB PN: *; Footprint: *
FB1 FB2 = FERRITE BEAD: MFR: TDK; MFR PN: MMZ1608Y102BTD25; Value: MMZ1608Y102BTD25; JLCPCB PN: C531293; Footprint: *
J6 = JST CONN 2POS PH: as J2 on sheet PWR-Switch; Type: SMD; Value: S2B-PH-SM4-TB; JLCPCB PN: C295747
Q6 Q7 = PMOS: as Q1 on sheet Boost; Footprint: *; JLCPCB PN: C110724
Q8-Q10 = NMOS: as Q3 on sheet MCU-BLE; MFR PN: IRLML0100TRPBF; JLCPCB PN: C53658
R47-R49 R67 R69 = RES: Resistor; MFR PN: *; MFR: *
  R47 R49: JLCPCB PN: C140218
  R48 R67: JLCPCB PN: *
  R69: JLCPCB PN: C843837
TP22-TP24 = TEST POINT: MFR: ronghe; MFR PN: RH-5019; Value: RH-5019; JLCPCB PN: C5199800
U7 = MAX98357AETE+T: I2S Audio DAC and amp; MFR: Analog Devices; Value: MAX98357AETE+T; Type: SMD; Footprint: *; JLCPCB PN: C910544

## Sheet Rotary-Encoder.SchDoc
size B; SheetNumber: 15; SheetTotal: 17
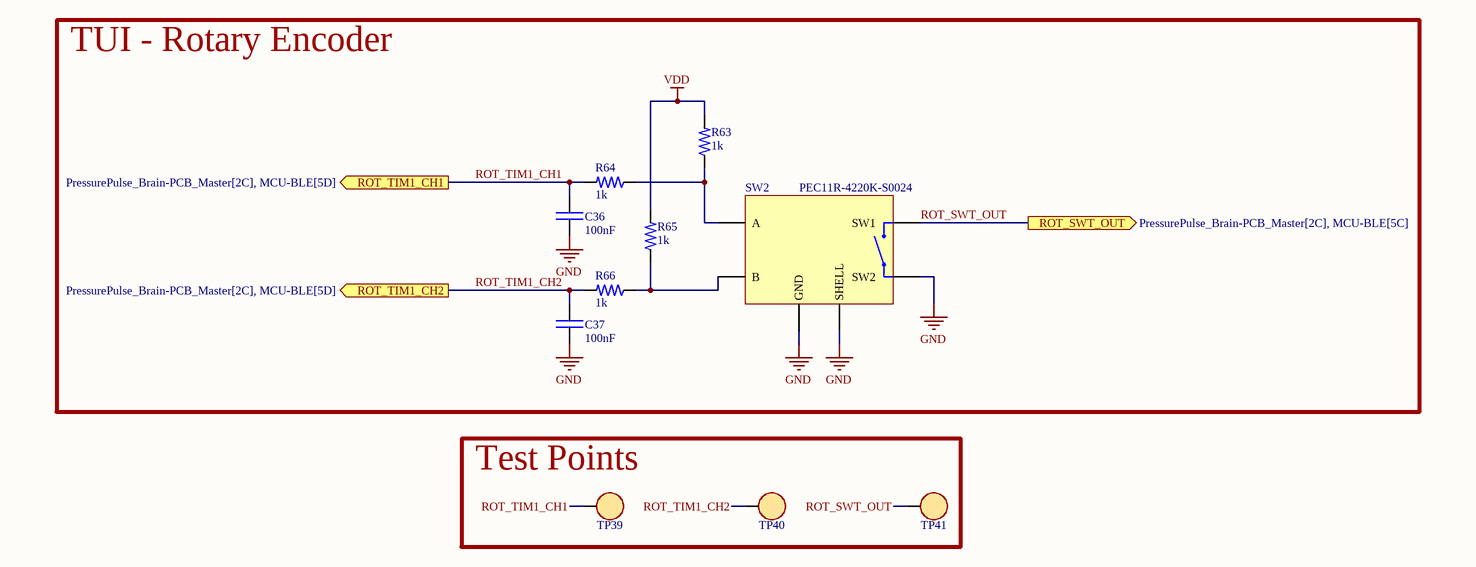
[diagram p14: Rotary-Encoder.SchDoc]

### Parts
C36  value 100nF  [0402C]  (hidden comment: CAP)
C37  value 100nF  [0402C]  (hidden comment: CAP)
R63  value 1k  [0402R]  (hidden comment: RES)
R64  value 1k  [0402R]  (hidden comment: RES)
R65  value 1k  [0402R]  (hidden comment: RES)
R66  value 1k  [0402R]  (hidden comment: RES)
SW2  PEC11R-4220K-S0024  [PEC11R-4220K-S0024]
TP39  RH-5019  [TP - RH-5019]  (value not drawn)
TP40  RH-5019  [TP - RH-5019]  (value not drawn)
TP41  RH-5019  [TP - RH-5019]  (value not drawn)

### Blocks framed on the sheet
TUI - Rotary Encoder: C36 C37 R63-R66 SW2
Test Points: TP39-TP41

### Ports
ROT_SWT_OUT (out, see PressurePulse_Brain-PCB_Master[2C], MCU-BLE[5C]), ROT_TIM1_CH1 (out, see PressurePulse_Brain-PCB_Master[2C], MCU-BLE[5D]), ROT_TIM1_CH2 (out, see PressurePulse_Brain-PCB_Master[2C], MCU-BLE[5D])

### Nets
GND: C36.1 C37.1 SW2.GND SW2.SHELL SW2.SW2
VDD: R63.2 R65.2
ROT_SWT_OUT: SW2.SW1 TP41.1 ; port ROT_SWT_OUT
ROT_TIM1_CH1: C36.2 R64.2 TP39.1 ; port ROT_TIM1_CH1
ROT_TIM1_CH2: C37.2 R66.2 TP40.1 ; port ROT_TIM1_CH2
NetR63_1: R63.1 R64.1 SW2.A
NetR65_1: R65.1 R66.1 SW2.B

### Library data of the parts
C36 C37 = CAP: Capacitor; MFR: *; MFR PN: *; JLCPCB PN: *; Footprint: *
R63-R66 = RES: Resistor; MFR PN: *; MFR: *; JLCPCB PN: *
SW2 = ROT ENCODER W SWITCH: Rotary Encoder Incremental 24 Quadrature, 2-Bit Vertical; MFR: Bourns Inc.; Value: DNS; MFR PN: PEC11R-4220K-S0024; JLCPCB PN: *
TP39-TP41 = TEST POINT: MFR: ronghe; MFR PN: RH-5019; Value: RH-5019; JLCPCB PN: C5199800

## Sheet Tacile-Buttons.SchDoc
size A; SheetNumber: 16; SheetTotal: 17
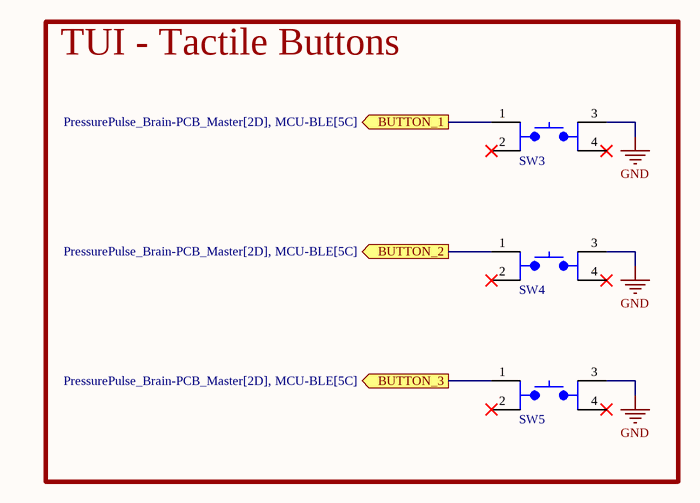
[diagram p15: Tacile-Buttons.SchDoc]

### Parts
SW3  SPDT SMT Tactile Push Button Switch  [TL6200]  (value not drawn)
SW4  SPDT SMT Tactile Push Button Switch  [TL6200]  (value not drawn)
SW5  SPDT SMT Tactile Push Button Switch  [TL6200]  (value not drawn)

### Blocks framed on the sheet
TUI - Tactile Buttons: SW3-SW5

### Ports
BUTTON_1 (out, see PressurePulse_Brain-PCB_Master[2D], MCU-BLE[5C]), BUTTON_2 (out, see PressurePulse_Brain-PCB_Master[2D], MCU-BLE[5C]), BUTTON_3 (out, see PressurePulse_Brain-PCB_Master[2D], MCU-BLE[5C])

### Nets
GND: SW3.3 SW4.3 SW5.3
NetSW3_1: SW3.1 ; port BUTTON_1
NetSW4_1: SW4.1 ; port BUTTON_2
NetSW5_1: SW5.1 ; port BUTTON_3

Not connected (* = marked no-connect by the designer): SW3 2* 4*; SW4 2* 4*; SW5 2* 4*

### Library data of the parts
SW3-SW5 = SPDT SMT Tactile Push Button Switch: Value: DNS; MFR: *; MFR PN: TL6200; JLCPCB PN: *

## Sheet Gyroscope.SchDoc
size A; SheetNumber: 17; SheetTotal: 17
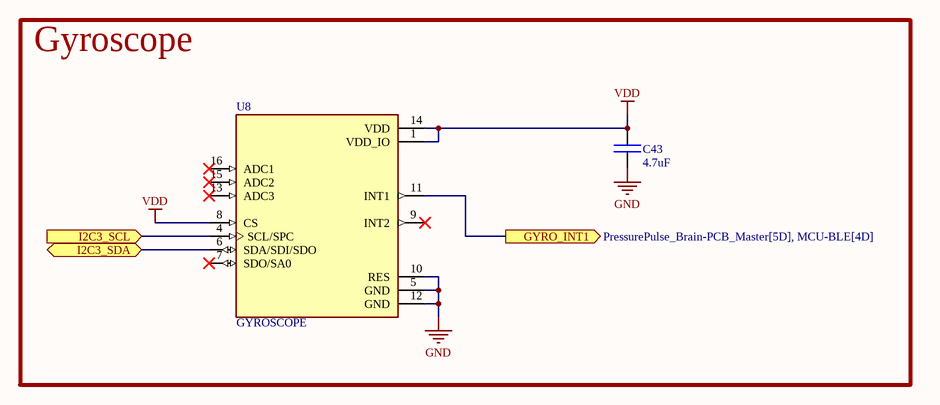
[diagram p16: Gyroscope.SchDoc]

### Parts
C43  value 4.7uF  [0402C]  (hidden comment: CAP)
U8  GYROSCOPE  [16-VFLGA]

### Blocks framed on the sheet
Gyroscope: C43 U8

### Ports
GYRO_INT1 (out, see PressurePulse_Brain-PCB_Master[5D], MCU-BLE[4D]), I2C3_SCL (in, see PressurePulse_Brain-PCB_Master[5D], Flow-Sensor[2C], Fuel-Gauge[4B], MCU-BLE[2D], Pressure-Sensor[1C]), I2C3_SDA (bidir, see PressurePulse_Brain-PCB_Master[5D], Flow-Sensor[3C], Fuel-Gauge[4B], MCU-BLE[2D], Pressure-Sensor[3C])

### Nets
GND: C43.1 U8.5(GND) U8.10(RES) U8.12(GND)
VDD: C43.2 U8.1(VDD_IO) U8.8(CS) U8.14(VDD)
I2C3_SCL: U8.4(SCL/SPC) ; port I2C3_SCL
I2C3_SDA: U8.6(SDA/SDI/SDO) ; port I2C3_SDA
NetU6_17: U8.11(INT1) ; port GYRO_INT1

Not connected (* = marked no-connect by the designer): U8 7(SDO/SA0)* 9(INT2)* 13(ADC3)* 15(ADC2)* 16(ADC1)*

### Library data of the parts
C43 = CAP: Capacitor; MFR: *; MFR PN: *; JLCPCB PN: *; Footprint: *
U8 = GYROSCOPE: Accelerometer X, Y, Z Axis Â±2g, 4g, 8g, 16g 0.5Hz ~ 625Hz 16-LGA (3x3); MFR: STMicroelectronics; Value: LIS3DHTR; MFR PN: LIS3DHTR; JLCPCB PN: C15134